# EasyEDA Pro project 外接板20260402.eprj, board PCB2
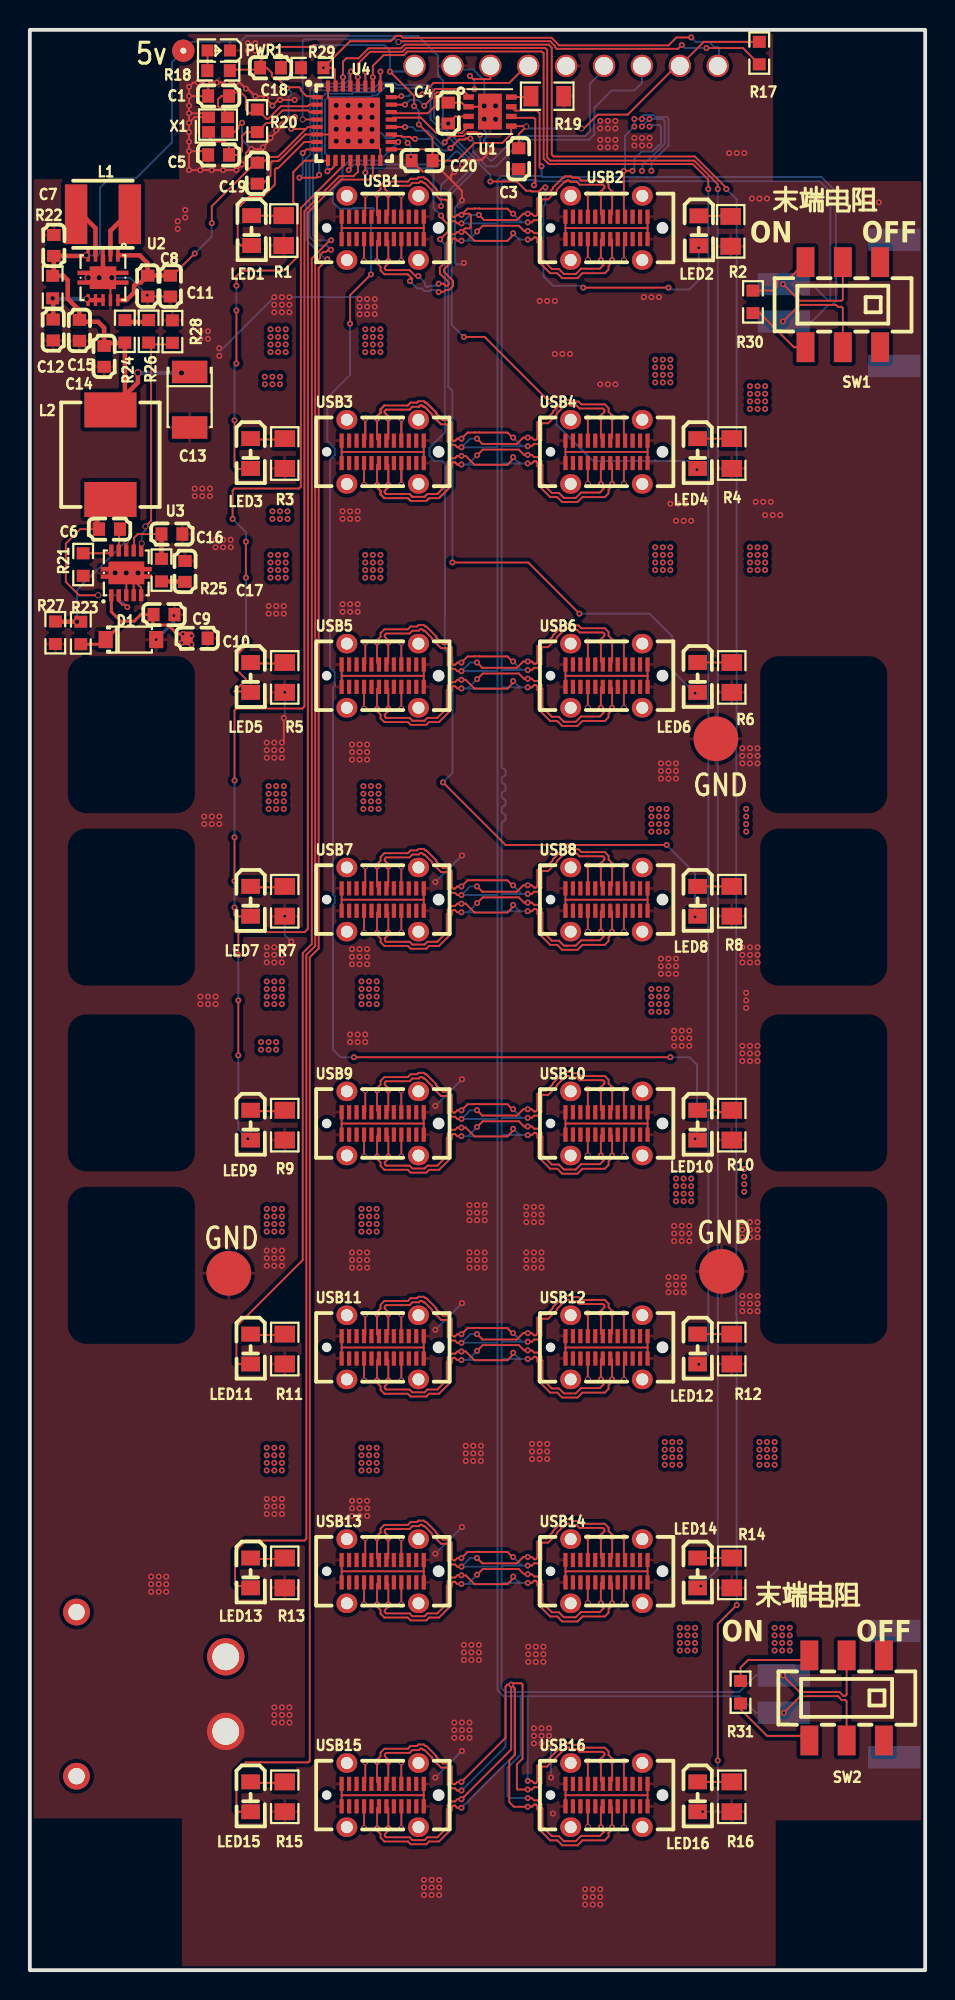
[diagram p2: board, top side]
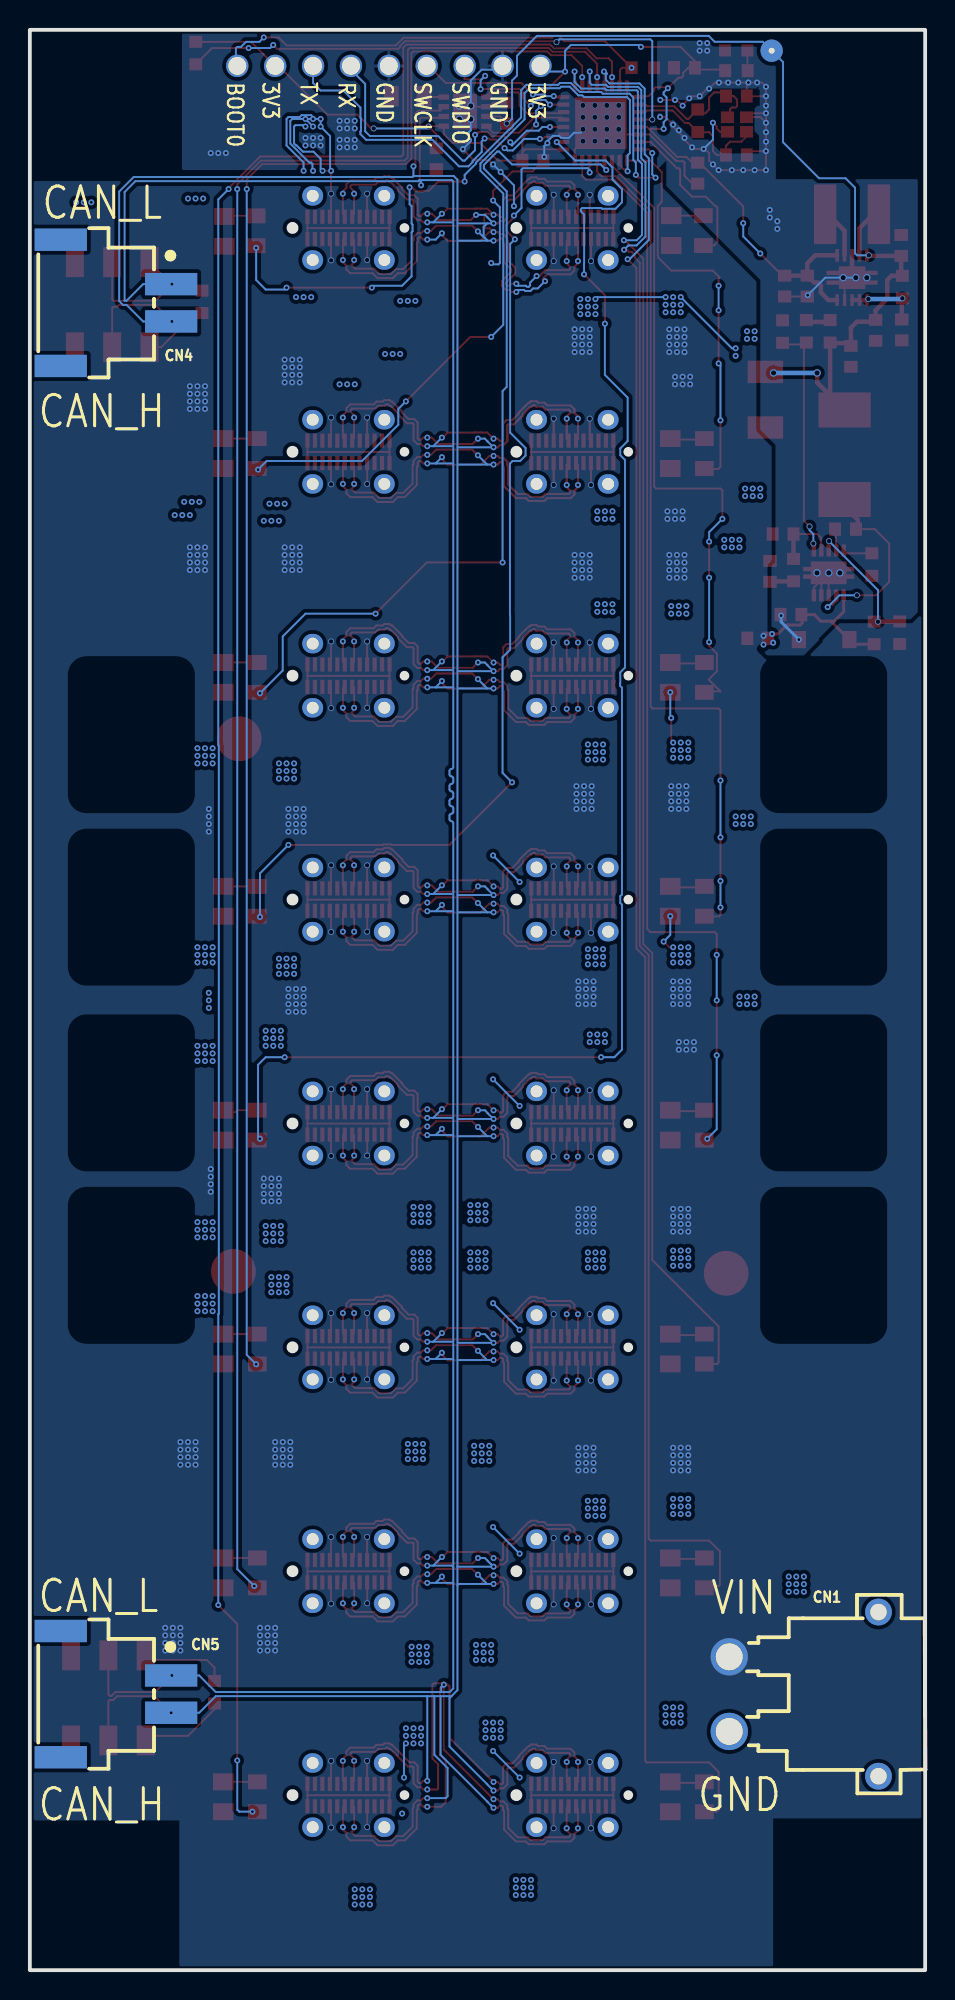
[diagram p3: board, bottom side, seen from below]

Outline 60 x 130 mm; copper layers: Top Layer, Bottom Layer. Coordinates in mm from the lower left corner of the outline.
Outline path: rectangle 0,130 60,0
Stack: Top Layer 0.035mm / Dielectric1 1.51mm FR4 er 4.5 / Bottom Layer 0.035mm

## Design rules (mm)
net OSC_IN: DP2
net OSC_OUT: DP2
net $2N36064: DP3
net $2N36070: DP3
net $2N36103: DP4
net $2N36110: DP4
template: 自定义配置
spacing copperThickness1oz (default): track to track 0.102, other pairs 0.152 to 0.3
spacing copperThickness2oz: track to track 0.203, other pairs 0.152 to 0.3
track width copperThickness1oz (default): min 0.127, default 0.127, max 2.54
track width copperThickness2oz: min 0.203, default 0.254, max 2.54
differential pair differentialPair (default): width min 0.127, default 0.254, max 2.54; gap min 0.152, default 0.152
via viaSize: diameter min 0.5, default 0.61, max 10; hole min 0.3, default 0.305, max 6.3
via viaSize1 (default): diameter min 0.25, default 0.3, max 10; hole min 0.15, default 0.2, max 6.3

## Placement (name value [footprint] x y rotation side)
C1  8pF  [C0603]  12.65 125.57 0 top
C3  100nF  [C0603]  32.76 121.37 90 top
C4  100nF  [C0603]  28.04 124.42 270 top
C5  8pF  [C0603]  12.65 121.62 0 top
C6  100nF  [C0603]  5.34 96.55 0 top
C7  10uF  [C0603]  1.61 115.56 270 top
C8  10UF  [C0603]  7.9 112.83 90 top
C9  10uF  [C0603]  8.99 90.82 180 top
C10  100nF  [C0603]  11.21 89.23 180 top
C11  10uF  [C0603]  9.42 112.83 90 top
C12  100nF  [C0603]  1.57 109.89 90 top
C13  47uF  [CASE-B_3528-A]  10.71 105.22 270 top
C14  47uF  [C0603]  4.98 108.12 90 top
C15  1uF  [C0603]  3.32 109.87 90 top
C16  120pF  [C0603]  9.52 96.22 180 top
C17  0.012uF  [C0603]  10.4 93.72 270 top
C18  100nF  [C0603]  16.13 127.46 180 top
C19  100nF  [C0603]  15.25 120.39 90 top
C20  100nF  [C0603]  26.29 121.24 180 top
CN1  XT30PW-M30.G.Y  [CONN-TH_XT30PW-M]  8.13 18.49 90 bottom
CN4  ZX-XH2.54-2PWT  [CONN-SMD_2P-P2.54_MEGASTAR_ZX-XH2.54-2PWT]  54.23 111.71 270 bottom
CN5  ZX-XH2.54-2PWT  [CONN-SMD_2P-P2.54_MEGASTAR_ZX-XH2.54-2PWT]  54.23 18.49 270 bottom
D1  SMF16A  [SOD-123_L2.8-W1.8-LS3.7-RD]  6.77 89.15 0 top
L1  2.2uH  [IND-SMD_L4.0-W4.0_LQH44PN2R2MP0L]  4.9 117.64 0 top
L2  15uH  [IND-SMD_L7.3-W6.8]  5.4 101.53 90 top
LED1  LS R976-NR-1-0-20-R18  [LED0805-RD_RED]  14.86 116.55 270 top
LED2  LS R976-NR-1-0-20-R18  [LED0805-RD_RED]  44.83 116.54 270 top
LED3  LS R976-NR-1-0-20-R18  [LED0805-RD_RED]  14.8 101.61 270 top
LED4  LS R976-NR-1-0-20-R18  [LED0805-RD_RED]  44.75 101.61 270 top
LED5  LS R976-NR-1-0-20-R18  [LED0805-RD_RED]  14.8 86.61 270 top
LED6  LS R976-NR-1-0-20-R18  [LED0805-RD_RED]  44.75 86.61 270 top
LED7  LS R976-NR-1-0-20-R18  [LED0805-RD_RED]  14.8 71.61 270 top
LED8  LS R976-NR-1-0-20-R18  [LED0805-RD_RED]  44.75 71.61 270 top
LED9  LS R976-NR-1-0-20-R18  [LED0805-RD_RED]  14.8 56.61 270 top
LED10  LS R976-NR-1-0-20-R18  [LED0805-RD_RED]  44.75 56.61 270 top
LED11  LS R976-NR-1-0-20-R18  [LED0805-RD_RED]  14.8 41.61 270 top
LED12  LS R976-NR-1-0-20-R18  [LED0805-RD_RED]  44.75 41.61 270 top
LED13  LS R976-NR-1-0-20-R18  [LED0805-RD_RED]  14.8 26.61 270 top
LED14  LS R976-NR-1-0-20-R18  [LED0805-RD_RED]  44.75 26.61 270 top
LED15  LS R976-NR-1-0-20-R18  [LED0805-RD_RED]  14.8 11.61 270 top
LED16  LS R976-NR-1-0-20-R18  [LED0805-RD_RED]  44.75 11.61 270 top
NOREF  -  [Pad_e3239]  43.56 127.59 0 top
NOREF#2  -  [Pad_e59]  33.4 127.59 0 top
NOREF#3  -  [Pad_e41]  28.32 127.59 0 top
NOREF#4  -  [Pad_e472]  45.97 82.5 0 top
NOREF#5  -  [Pad_e1667]  41.02 127.59 0 top
NOREF#6  -  [Pad_e58]  30.86 127.59 0 top
NOREF#7  -  [Pad_e466]  46.35 46.81 0 top
NOREF#8  -  [Pad_e1678]  38.48 127.59 0 top
NOREF#9  -  [Pad_e3249]  10.29 128.6 0 top
NOREF#10  -  [Pad_e4677]  46.1 127.59 0 top
NOREF#11  -  [Pad_e1689]  35.94 127.59 0 top
NOREF#12  -  [Pad_e40]  25.78 127.59 0 top
NOREF#13  -  [Pad_e468]  13.34 46.69 0 top
PWR1  GL0603UG01  [LED0603-RD]  12.66 128.62 180 top
R1  1kΩ  [R0805#2]  17.02 116.55 270 top
R2  1kΩ  [R0805#2]  46.96 116.5 270 top
R3  1kΩ  [R0805#2]  17.08 101.61 270 top
R4  1kΩ  [R0805#2]  47.04 101.61 270 top
R5  1kΩ  [R0805#2]  17.08 86.61 270 top
R6  1kΩ  [R0805#2]  47.04 86.61 270 top
R7  1kΩ  [R0805#2]  17.08 71.61 270 top
R8  1kΩ  [R0805#2]  47.04 71.61 270 top
R9  1kΩ  [R0805#2]  17.08 56.61 270 top
R10  1kΩ  [R0805#2]  47.04 56.61 270 top
R11  1kΩ  [R0805#2]  17.08 41.61 270 top
R12  1kΩ  [R0805#2]  47.04 41.61 270 top
R13  1kΩ  [R0805#2]  17.08 26.61 270 top
R14  1kΩ  [R0805#2]  47.04 26.61 270 top
R15  1kΩ  [R0805#2]  17.08 11.61 270 top
R16  1kΩ  [R0805#2]  47.04 11.61 270 top
R17  10K  [R0603]  48.88 128.44 90 top
R18  1K  [R0603]  12.65 127.27 0 top
R19  10K  [R0805]  34.67 125.56 0 top
R20  1MΩ  [R0603]  15.24 123.9 90 top
R21  143K  [R0603]  3.57 94.17 90 top
R22  100  [R0603]  1.53 112.77 90 top
R23  220K  [R0603]  3.42 89.59 270 top
R24  51.1  [R0603]  6.37 109.8 270 top
R25  3.74K  [R0603]  8.82 93.8 90 top
R26  100K  [R0603]  7.96 109.8 90 top
R27  43.2K  [R0603]  1.71 89.61 90 top
R28  19.1K  [R0603]  9.55 109.78 270 top
R29  10K  [R0603]  18.92 127.46 0 top
R30  120  [R0603]  48.46 111.78 270 top
R31  120  [R0603]  47.62 18.62 270 top
SW1  MST22D18G2 125  [SW-SMD_MST22D18G2]  54.48 111.59 180 top
SW2  MST22D18G2 125  [SW-SMD_MST22D18G2]  54.74 18.24 180 top
U1  TJA1051TK/3/1J  [HVSON-8_L3.0-W3.0-P0.65-BL-EP]  30.83 124.52 270 top
U2  TPS63001DRCR  [VSON-10_L3.0-W3.0-P0.50-TL-EP_TPS62410DRCR]  4.9 113.39 270 top
U3  TPS54335ADRCR  [VSON-10_L3.0-W3.0-P0.50-TL-EP]  6.46 93.62 90 top
U4  STM32F302K8U6TR  [UFQFPN-32_L5.0-W5.0-P0.50-TL-EP3.5]  21.73 123.74 0 top
USB1  MC-236LS-L64  [TYPE-C-USB-SMD_TYPE-C-31-M-06]  23.65 116.73 0 top
USB2  MC-236LS-L64  [TYPE-C-USB-SMD_TYPE-C-31-M-06]  38.65 116.73 0 top
USB3  MC-236LS-L64  [TYPE-C-USB-SMD_TYPE-C-31-M-06]  23.65 101.73 0 top
USB4  MC-236LS-L64  [TYPE-C-USB-SMD_TYPE-C-31-M-06]  38.65 101.73 0 top
USB5  MC-236LS-L64  [TYPE-C-USB-SMD_TYPE-C-31-M-06]  23.65 86.73 0 top
USB6  MC-236LS-L64  [TYPE-C-USB-SMD_TYPE-C-31-M-06]  38.65 86.73 0 top
USB7  MC-236LS-L64  [TYPE-C-USB-SMD_TYPE-C-31-M-06]  23.65 71.73 0 top
USB8  MC-236LS-L64  [TYPE-C-USB-SMD_TYPE-C-31-M-06]  38.65 71.73 0 top
USB9  MC-236LS-L64  [TYPE-C-USB-SMD_TYPE-C-31-M-06]  23.65 56.73 0 top
USB10  MC-236LS-L64  [TYPE-C-USB-SMD_TYPE-C-31-M-06]  38.65 56.73 0 top
USB11  MC-236LS-L64  [TYPE-C-USB-SMD_TYPE-C-31-M-06]  23.65 41.73 0 top
USB12  MC-236LS-L64  [TYPE-C-USB-SMD_TYPE-C-31-M-06]  38.65 41.73 0 top
USB13  MC-236LS-L64  [TYPE-C-USB-SMD_TYPE-C-31-M-06]  23.65 26.73 0 top
USB14  MC-236LS-L64  [TYPE-C-USB-SMD_TYPE-C-31-M-06]  38.65 26.73 0 top
USB15  MC-236LS-L64  [TYPE-C-USB-SMD_TYPE-C-31-M-06]  23.65 11.73 0 top
USB16  MC-236LS-L64  [TYPE-C-USB-SMD_TYPE-C-31-M-06]  38.65 11.73 0 top
X1  24MHz  [CRYSTAL-SMD_4P-L2.0-W1.6-BL-A]  12.61 123.65 0 top

## Footprints (pads in the part's own frame, mm; a bottom-side part is the same pattern mirrored in y, then rotated)
C0603
  rect 0.8x0.9 smd: 1(-0.7,0) 2(0.7,0)
CASE-B_3528-A
  rect 1.506x2.376 smd: 1(-1.861,0) 2(1.861,0)
CONN-SMD_2P-P2.54_MEGASTAR_ZX-XH2.54-2PWT
  rect 1.5x3.5 smd: 1(-1.25,3.7) 2(1.25,3.7) 3(-4.23,-3.7) 4(4.23,-3.7)
CONN-TH_XT30PW-M
  round 2.5 hole 1.8: 1(-2.5,5) 2(2.5,5)
  round 1.8 hole 1.1: 3(5.5,-5) 4(-5.5,-5)
CRYSTAL-SMD_4P-L2.0-W1.6-BL-A
  rect 0.875x0.775 smd: 1(-0.638,-0.488) 2(0.638,-0.488) 3(0.638,0.488) 4(-0.638,0.488)
HVSON-8_L3.0-W3.0-P0.65-BL-EP
  rect 0.355x0.711 smd: 1(-0.976,-1.433) 2(-0.325,-1.433) 3(0.325,-1.433) 4(0.976,-1.433) 5(0.976,1.433) 6(0.325,1.433) 7(-0.325,1.433) 8(-0.976,1.433)
  rect 2.401x1.6 smd: 9(0,0)
IND-SMD_L4.0-W4.0_LQH44PN2R2MP0L
  rect 1.5x4 smd: 1(-1.8,0) 2(1.8,0)
IND-SMD_L7.3-W6.8
  rect 2.349x3.5 smd: 1(-2.999,0) 2(2.999,0)
LED0603-RD
  rect 0.8x0.8 smd: 1(-0.749,0) 2(0.749,0)
LED0805-RD_RED
  rect 1x1.25 smd: 1(-1,0) 2(1,0)
Pad_e40
  round 1.5 hole 1.2: 1(0,0)
Pad_e41
  round 1.5 hole 1.2: 1(0,0)
Pad_e58
  round 1.5 hole 1.2: 1(0,0)
Pad_e59
  round 1.5 hole 1.2: 1(0,0)
Pad_e466
  round 3 smd: TP2(0,0)
Pad_e468
  round 3 smd: TP2(0,0)
Pad_e472
  round 3 smd: TP2(0,0)
Pad_e1667
  round 1.5 hole 1.2: 1(0,0)
Pad_e1678
  round 1.5 hole 1.2: 1(0,0)
Pad_e1689
  round 1.5 hole 1.2: 1(0,0)
Pad_e3239
  round 1.5 hole 1.2: 1(0,0)
Pad_e3249
  round 1.5 hole 0.4: 1(0,0)
Pad_e4677
  round 1.5 hole 1.2: 1(0,0)
R0603
  rect 0.806x0.864 smd: 1(-0.753,0) 2(0.753,0)
R0805
  rect 1x1.377 smd: 1(-1.092,0) 2(1.105,0)
R0805#2
  rect 1.133x1.377 smd: 1(-1,0) 2(1,0)
SOD-123_L2.8-W1.8-LS3.7-RD
  rect 0.95x1.15 smd: 1(-1.692,0) 2(1.692,0)
SW-SMD_MST22D18G2
  rect 1.2x2 smd: 1(-2.5,2.85) 2(0,2.85) 3(2.5,2.85) 4(-2.5,-2.85) 5(0,-2.85) 6(2.5,-2.85)
TYPE-C-USB-SMD_TYPE-C-31-M-06
  oval 1.4x1.3 hole 0.8: 25(-2.401,2.15) 25(-2.401,-2.15) 25(2.399,2.15) 25(2.399,-2.15)
  rect 0.28x0.95 smd: A1(-2.751,0.75) A2(-2.251,0.75) A3(-1.751,0.75) A4(-1.251,0.75) A5(-0.751,0.75) A6(-0.251,0.75) A7(0.249,0.75) A8(0.749,0.75) A9(1.249,0.75) A10(1.749,0.75) A11(2.249,0.75) A12(2.749,0.75) B1(2.751,-0.751) B2(2.251,-0.751) B3(1.751,-0.751) B4(1.251,-0.751) B5(0.751,-0.751) B6(0.251,-0.751) B7(-0.249,-0.751) B8(-0.749,-0.751) B9(-1.249,-0.751) B10(-1.749,-0.751) B11(-2.249,-0.751) B12(-2.749,-0.751)
UFQFPN-32_L5.0-W5.0-P0.50-TL-EP3.5
  rect 0.75x0.28 smd: 1(-2.49,1.75) 2(-2.49,1.25) 3(-2.49,0.75) 4(-2.49,0.25) 5(-2.49,-0.25) 6(-2.49,-0.75) 7(-2.49,-1.25) 8(-2.49,-1.75) 17(2.49,-1.75) 18(2.49,-1.25) 19(2.49,-0.75) 20(2.49,-0.25) 21(2.49,0.25) 22(2.49,0.75) 23(2.49,1.25) 24(2.49,1.75)
  rect 0.28x0.75 smd: 9(-1.75,-2.49) 10(-1.25,-2.49) 11(-0.75,-2.49) 12(-0.25,-2.49) 13(0.25,-2.49) 14(0.75,-2.49) 15(1.25,-2.49) 16(1.75,-2.49) 25(1.75,2.49) 26(1.25,2.49) 27(0.75,2.49) 28(0.25,2.49) 29(-0.25,2.49) 30(-0.75,2.49) 31(-1.25,2.49) 32(-1.75,2.49)
  rect 3.45x3.45 smd: 33(0,0)
VSON-10_L3.0-W3.0-P0.50-TL-EP
  rect 0.8x0.3 smd: 1(-1.5,1) 2(-1.5,0.5) 3(-1.5,0) 4(-1.5,-0.5) 5(-1.5,-1) 6(1.5,-1) 7(1.5,-0.5) 8(1.5,0) 9(1.5,0.5) 10(1.5,1)
  custom 1.52x3.42 smd: 11(0.002,-0.009)
VSON-10_L3.0-W3.0-P0.50-TL-EP_TPS62410DRCR
  rect 0.85x0.24 smd: 1(-1.5,1) 2(-1.5,0.5) 3(-1.5,0) 4(-1.5,-0.5) 5(-1.5,-1)
  rect 0.8x0.23 smd: 6(1.5,-1) 7(1.5,-0.5) 8(1.5,0) 9(1.5,0.5) 10(1.5,1)
  custom 1.52x3.42 smd: 11(0,-0.005)

## Nets
As in the schematic, except:
3V3: C3.2 C8.2 C11.2 C18.2 C19.2 C20.1 NOREF.1 NOREF#12.1 R17.2 R18.2 U1.5 U2.1 U2.10 U4.1 U4.5 U4.17
+5V: C4.2 C7.2 C13.1 C14.2 C15.2 L2.2 NOREF#9.1 R22.2 R24.2 U1.3 U2.5
GND: C1.1 C3.1 C4.1 C5.1 C7.1 C8.1 C9.1 C10.1 C11.1 C12.1 C13.2 C14.1 C15.1 C16.1 C17.1 C18.1 C19.1 C20.2 CN1.1 D1.2 NOREF#3.1 NOREF#4.TP2 NOREF#7.TP2 NOREF#11.1 NOREF#13.TP2 PWR1.1 R1.2 R2.2 R3.2 R4.2 R5.2 R6.2 R7.2 R8.2 R9.2 R10.2 R11.2 R12.2 R13.2 R14.2 R15.2 R16.2 R19.2 R21.1 R27.1 R28.1 R29.1 U1.2 U1.9 U2.3 U2.9 U2.11 U3.3 U3.4 U3.5 U3.11 U4.6 U4.16 U4.32 U4.33 USB1.A1 USB1.A12 USB1.B1 USB1.B12 USB2.A1 USB2.A12 USB2.B1 USB2.B12 USB3.A1 USB3.A12 USB3.B1 USB3.B12 USB4.A1 USB4.A12 USB4.B1 USB4.B12 USB5.A1 USB5.A12 USB5.B1 USB5.B12 USB6.A1 USB6.A12 USB6.B1 USB6.B12 USB7.A1 USB7.A12 USB7.B1 USB7.B12 USB8.A1 USB8.A12 USB8.B1 USB8.B12 USB9.A1 USB9.A12 USB9.B1 USB9.B12 USB10.A1 USB10.A12 USB10.B1 USB10.B12 USB11.A1 USB11.A12 USB11.B1 USB11.B12 USB12.A1 USB12.A12 USB12.B1 USB12.B12 USB13.A1 USB13.A12 USB13.B1 USB13.B12 USB14.A1 USB14.A12 USB14.B1 USB14.B12 USB15.A1 USB15.A12 USB15.B1 USB15.B12 USB16.A1 USB16.A12 USB16.B1 USB16.B12 X1.2 X1.4
BOOT0: NOREF#10.1 R29.2 U4.31
RX: NOREF#8.1 U4.20
SWCLK: NOREF#2.1 U4.24
SWDIO: NOREF#6.1 U4.23
TX: NOREF#5.1 U4.19

Pads without a net: CN1 3 4; CN4 3 4; CN5 3 4; SW1 1 4; SW2 1 4; USB1 25 A2 A3 A5 A8 A10 A11 B2 B3 B5 B8 B10 B11; USB2 25 A2 A3 A5 A8 A10 A11 B2 B3 B5 B8 B10 B11; USB3 25 A2 A3 A5 A8 A10 A11 B2 B3 B5 B8 B10 B11; USB4 25 A2 A3 A5 A8 A10 A11 B2 B3 B5 B8 B10 B11; USB5 25 A2 A3 A5 A8 A10 A11 B2 B3 B5 B8 B10 B11; USB6 25 A2 A3 A5 A8 A10 A11 B2 B3 B5 B8 B10 B11; USB7 25 A2 A3 A5 A8 A10 A11 B2 B3 B5 B8 B10 B11; USB8 25 A2 A3 A5 A8 A10 A11 B2 B3 B5 B8 B10 B11; USB9 25 A2 A3 A5 A8 A10 A11 B2 B3 B5 B8 B10 B11; USB10 25 A2 A3 A5 A8 A10 A11 B2 B3 B5 B8 B10 B11; USB11 25 A2 A3 A5 A8 A10 A11 B2 B3 B5 B8 B10 B11; USB12 25 A2 A3 A5 A8 A10 A11 B2 B3 B5 B8 B10 B11; USB13 25 A2 A3 A5 A8 A10 A11 B2 B3 B5 B8 B10 B11; USB14 25 A2 A3 A5 A8 A10 A11 B2 B3 B5 B8 B10 B11; USB15 25 A2 A3 A5 A8 A10 A11 B2 B3 B5 B8 B10 B11; USB16 25 A2 A3 A5 A8 A10 A11 B2 B3 B5 B8 B10 B11

## Via types
v1: diameter 0.4, hole 0.2, Top Layer to Bottom Layer, 1050 vias
v2: diameter 0.4, hole 0.35, Top Layer to Bottom Layer, 16 vias
v3: diameter 0.5, hole 0.35, Top Layer to Bottom Layer, 12 vias
v4: diameter 0.4, hole 0.3, Top Layer to Bottom Layer, 77 vias

## Routing (per net, layer and track width the routed paths; a pad name or vN(x,y) marks a point on that pad's centre or on a via; arc(x,y) is an arc through that point)
3V3: length 84.3
  Top Layer w0.127: 9.44,113.53 9.57,113.53 v1(11.05,115.01) ; v1(25.75,124.89) 25.75,125.58 v1(24.13,127.21) ; 19.24,123.49 18.64,123.49 18.51,123.36 ; 18.51,123.36 16.64,121.49 16,121.49 15.6,121.09 C19.2 ; 18.51,123.36 v1(17.53,123.36) ; 19.24,125.49 19.18,125.56 18.54,125.56 18.16,125.94 18.16,126.06 18.07,126.15 17.31,126.15 v1(17.25,126.09) 16.54,126.79 16.34,126.79 16.21,126.92 16.21,127.12 15.88,127.46 C18.2 15.43,127.9 16.38,128.86 v1(19.05,128.86) ; U4.17 24.23,122 26.8,122 26.99,121.81 ; 15.8,127.33 13.72,127.33 13.4,127.01 ; 26.99,121.81 26.99,122.74 v1(26.07,123.66) ; 26.99,121.81 C20.1 28.62,121.24 29.81,122.42 31.67,122.42 32.26,123.02 32.26,123.54 32.26,123.55 33.25,123.55 v4(33.27,123.52) 32.77,123.02 32.77,122.08 C3.2 ; v4(36.96,123.4) 37.13,123.4 38.06,124.32 40.07,124.32 42.93,127.18 43.56,127.18 ; NOREF.1 45.17,129.2 R17.2 ; v1(12.19,117.05) 12.19,118.18 15.26,121.25 15.26,121.47
  Top Layer w0.3: C11.2 C8.2 ; C8.2 7.9,114.36 7.36,114.89 U2.1 ; C8.2 7.43,113.07 7.2,113.07 6.98,112.85 6.98,112.4 6.48,111.89 U2.10
  Bottom Layer w0.127: v1(11.05,115.01) 12.19,116.16 v1(12.19,117.05) ; v1(26.07,123.66) 26.07,124.57 v1(25.75,124.89) ; v4(33.27,123.52) 33.4,123.4 v4(36.96,123.4) ; 25.78,127.08 25.65,127.21 v1(24.13,127.21) 24.13,128.6 23.75,128.98 19.14,128.98 19.05,128.89 v1(19.05,128.86) ; v1(17.53,123.36) 17.53,123.81 17.33,124.01 17.33,125.47 17.53,125.67 17.53,125.81 v1(17.25,126.09)
+5V: length 65.1
  Top Layer w0.127: v4(28.04,123.72) 28.51,124.2 U1.3
  Top Layer w0.3: v3(7.24,107.01) 7.24,106.37 L2.2 ; v4(3.77,114.89) 3.74,114.86 C7.2 1.61,113.6 1.53,113.52 2.25,113.52 2.54,113.24 2.54,111.99 3.32,111.2 C15.2 ; 5.04,109.01 6.28,109.01 6.37,108.92 6.37,105.63 5.4,104.66 ; 4.92,109.01 4.98,109.08 4.98,110.04 4.57,110.44 3.32,110.44
  Bottom Layer w0.127: v4(3.77,114.89) 4.57,114.89 4.7,115.02 4.7,119.42 5.33,120.06 7.11,120.06 9.52,122.47 9.52,127.84 NOREF#9.1 10.88,129.2 14.11,129.2 14.5,129.59 26.02,129.59 27.36,128.26 27.36,126.93 27.69,126.6 27.69,124.04 28,123.72 v4(28.04,123.72)
  Bottom Layer w0.3: v3(7.24,107.01) v3(10.16,107.01)
GND: length 258.5
  Top Layer w0.127: 26.4,26.71 USB13.B1 ; 26.4,26.71 26.38,26.72 20.9,26.72 ; 26.4,26.71 26.4,27.48 USB13.A12 ; 20.9,86.72 USB5.B12 ; 20.9,86.72 20.9,87.48 USB5.A1 ; 20.9,86.72 26.38,86.72 26.4,86.71 ; 41.4,71.71 41.4,72.48 USB8.A12 ; 41.4,71.71 41.38,71.72 35.9,71.72 ; 41.4,71.71 USB8.B1 ; 35.9,116.72 35.9,117.48 USB2.A1 ; 35.9,116.72 41.38,116.72 41.4,116.71 ; 35.9,116.72 USB2.B12 ; v1(10.67,121.87) 11.7,121.87 C5.1 ; v1(10.67,121.87) v1(10.67,120.6) v1(11.43,120.6) v1(12.19,120.6) v1(12.95,120.6) v1(13.84,120.6) v1(14.22,120.98) 14.48,121.24 14.48,121.75 14.75,122.02 v1(14.85,122.02) 15.51,122.02 v1(15.62,122.13) 16.13,122.63 v1(16.13,122.76) 16.89,123.52 v1(16.89,123.65) 17.4,124.16 v1(17.76,124.16) ; v1(10.67,121.87) v1(10.67,122.51) v1(10.67,123.14) v1(10.67,123.78) ; 41.4,56.71 41.38,56.72 35.9,56.72 ; 41.4,56.71 41.4,57.48 USB10.A12 ; 41.4,56.71 USB10.B1 ; 20.9,56.72 26.38,56.72 26.4,56.71 ; 20.9,56.72 USB9.B12 ; 20.9,56.72 20.9,57.48 USB9.A1 ; 20.9,71.72 26.38,71.72 26.4,71.71 ; 20.9,71.72 USB7.B12 ; 20.9,71.72 20.9,72.48 USB7.A1 ; USB16.A12 41.4,12.48 41.4,11.71 ; 41.4,101.71 41.38,101.72 35.9,101.72 ; 41.4,101.71 USB4.B1 ; 41.4,101.71 41.4,102.48 USB4.A12 ; X1.2 13.74,123.16 13.97,123.4 13.97,123.52 v1(14.22,123.78) ; 35.9,56.72 USB10.B12 ; 35.9,56.72 35.9,57.48 USB10.A1 ; 26.4,41.71 26.4,42.48 USB11.A12 ; 26.4,41.71 26.38,41.72 20.9,41.72 ; 26.4,41.71 USB11.B1 ; 6.96,93.13 U3.11 6.47,92.12 U3.3 ; 6.96,93.13 7.46,92.63 U3.5 ; 6.96,93.13 U3.4 ; 41.4,41.71 41.4,42.48 USB12.A12 ; 41.4,41.71 41.38,41.72 35.9,41.72 ; 41.4,41.71 USB12.B1 ; 41.4,11.71 41.38,11.72 35.9,11.72 ; 41.4,11.71 USB16.B1 ; 11.84,124.27 X1.4 ; 11.84,124.27 11.72,124.16 11.05,124.16 v1(10.67,123.78) ; 11.84,124.27 11.7,124.41 v1(10.67,124.41) ; 26.4,71.71 26.4,72.48 USB7.A12 ; 26.4,71.71 USB7.B1 ; 35.9,101.72 USB4.B12 ; 35.9,101.72 35.9,102.48 USB4.A1 ; v1(17.53,68.91) 17.15,68.53 v1(16.89,68.53) ; USB6.A1 35.9,87.48 35.9,86.72 ; v1(10.67,125.56) v1(10.67,126.19) 10.95,126.47 v1(11.26,126.47) v1(11.84,126.47) ; v1(10.67,125.56) 11.81,125.56 11.82,125.57 ; v1(10.67,125.56) v1(10.67,124.92) v1(10.67,124.41) ; v1(28.96,118.57) 28.96,119.2 28.24,119.92 ; 35.9,26.72 35.9,27.48 USB14.A1 ; 35.9,26.72 41.38,26.72 41.4,26.71 ; 35.9,26.72 USB14.B12 ; 26.4,101.71 USB3.B1 ; 26.4,101.71 26.4,102.48 USB3.A12 ; 26.4,101.71 26.38,101.72 20.9,101.72 ; 26.4,11.71 26.38,11.72 20.9,11.72 ; 26.4,11.71 26.4,12.48 USB15.A12 ; 26.4,11.71 USB15.B1 ; 35.9,71.72 USB8.B12 ; 35.9,71.72 35.9,72.48 USB8.A1 ; USB15.A1 20.9,12.48 20.9,11.72 ; 20.9,101.72 USB3.B12 ; 20.9,101.72 20.9,102.48 USB3.A1 ; v1(7.87,112.22) 7.96,112.13 C11.1 ; C4.1 28.94,125.12 29.09,124.97 29.27,124.97 U1.2 30.4,124.85 v3(30.45,124.9) ; 41.4,116.71 41.4,117.48 USB2.A12 ; 41.4,116.71 USB2.B1 ; 28.24,119.92 28.24,120.27 v1(28.45,120.47) ; 28.24,119.92 27.65,120.51 26.31,120.51 C20.2 ; v3(5.49,113.39) 5.4,113.3 U2.9 ; 35.9,11.72 35.9,12.48 USB16.A1 ; 35.9,11.72 USB16.B12 ; 26.4,56.71 USB9.B1 ; 26.4,56.71 26.4,57.48 USB9.A12 ; 41.4,86.71 USB6.B1 ; 41.4,86.71 41.38,86.72 35.9,86.72 ; 41.4,86.71 41.4,87.48 USB6.A12 ; C1.1 11.95,126.36 v1(11.84,126.47) ; 20.9,41.72 USB11.B12 ; 20.9,41.72 20.9,42.48 USB11.A1 ; 20.9,11.72 USB15.B12 ; 35.9,41.72 35.9,42.48 USB12.A1 ; 35.9,41.72 USB12.B12 ; 20.9,26.72 USB13.B12 ; 20.9,26.72 20.9,27.48 USB13.A1 ; U4.33 22.05,123.42 23.48,121.99 23.48,121.25 ; U4.33 21.25,124.22 19.98,125.49 U4.32 ; U4.33 v2(21.33,123.34) 20.98,122.99 18.46,122.99 16.73,121.26 16.7,121.26 16.64,121.2 16.22,121.2 16.13,121.11 16.13,120.22 15.62,119.71 15.37,119.71 15.25,119.83 C19.1 ; v1(10.67,123.78) v1(10.67,124.41) ; 26.4,86.71 26.4,87.48 USB5.A12 ; 26.4,86.71 USB5.B1 ; 41.4,26.71 41.4,27.48 USB14.A12 ; 41.4,26.71 USB14.B1 ; 35.9,86.72 USB6.B12 ; 26.4,116.71 26.38,116.72 20.9,116.72 ; 26.4,116.71 26.4,117.48 USB1.A12 ; 26.4,116.71 USB1.B1 ; 20.9,116.72 USB1.B12 ; 20.9,116.72 20.9,117.48 USB1.A1 ; v1(17.75,125.3) v1(16.76,125.3) 16.64,125.3 v1(16.26,124.92) 16.26,124.97 v1(15.81,125.41) 15.67,125.56 v1(15.11,125.56) 14.6,126.06 v1(14.48,126.06) 14.07,126.47 v1(13.82,126.47) v1(13.21,126.47) v1(12.53,126.47) v1(11.84,126.47) ; v1(16.89,82.25) 17.02,82.38 v1(17.02,83.9) ; v1(28.96,120.98) 29.25,121.27 30.26,121.27 30.98,121.99 v1(30.98,122.01)
  Top Layer w0.3: v3(5.49,113.39) 4.9,113.99 U2.3
  Bottom Layer w0.127: v1(34.93,12.91) 34.93,15.06 v1(34.8,15.19) ; v1(27.56,118.19) 27.56,119.59 v1(28.45,120.47) v1(28.96,120.98) ; U2.11 v3(5.49,113.39) 6.7,113.39 v1(7.87,112.22) ; v1(27.18,27.91) v1(28.96,29.68) ; v1(16.38,112.09) 12.95,108.66 v1(12.7,108.66) ; v1(14.22,123.78) 14.22,122.64 v1(14.85,122.02) ; v1(17.4,112.09) 21.97,112.09 v1(22.1,111.97) ; v1(17.53,68.91) 17.08,69.36 v1(17.08,70.61) ; v1(30.98,122.01) 30.45,122.54 30.45,122.67 30.58,122.8 30.58,123.14 30.45,123.27 v3(30.45,124.01) ; v1(17.02,83.9) 17.08,83.96 v1(17.08,85.61) ; 23.06,123.11 23.53,123.11 23.88,122.76 24.38,122.76 24.52,122.9 24.95,122.9 25.32,122.53 v1(25.32,122.41) 25.53,122.2 v1(25.53,121.49) ; v1(27.18,12.91) v1(28.96,14.68) ; v1(29.08,114.38) 28.99,114.29 28.59,114.29 28.5,114.38 28.5,118.11 v1(28.96,118.57) ; v1(27.18,72.91) v1(28.96,74.68) ; v1(27.18,57.91) v1(28.96,59.68) ; v3(30.45,124.9) 30.45,126.6 29.72,127.33 28.32,127.33 ; v1(27.18,42.91) v1(28.96,44.68)
  Bottom Layer w0.2: v1(8.47,89.15) 9.65,90.33 v1(9.65,90.76)
  vias: v1(8.13,26.37) v1(8.13,25.86) v1(8.13,25.35) v1(8.64,26.37) v1(8.64,25.86) v1(8.64,25.35) v1(9.14,26.37) v1(9.14,25.86) v1(9.14,25.35) v1(9.91,117.17) v1(9.91,116.66) v1(10.41,117.94) v1(10.41,117.43) v1(11.05,99.27) v1(11.05,98.76) v1(11.43,109.81) v1(11.43,109.3) v1(11.43,65.23) v1(11.43,64.72) v1(11.56,99.27) v1(11.56,98.76) v1(11.68,77.3) v1(11.68,76.79) v1(11.94,109.81) v1(11.94,109.3) v1(11.94,65.23) v1(11.94,64.72) v1(12.06,99.27) v1(12.06,98.76) v1(12.19,77.3) v1(12.19,76.79) v1(12.45,95.84) v1(12.45,95.33) v1(12.45,65.23) v1(12.45,64.72) v1(12.7,108.16) v1(12.7,77.3) v1(12.7,76.79) v1(12.95,95.84) v1(12.95,95.33) v1(13.46,95.84) v1(13.46,95.33) v1(14.6,129.11) v1(14.6,128.6) v1(15.11,129.11) v1(15.11,128.6) v1(15.87,82.25) v1(15.87,81.74) v1(15.87,81.23) v1(15.87,68.53) v1(15.87,68.02) v1(15.87,67.52) v1(15.87,48.21) v1(15.87,47.7) v1(15.87,47.2) v1(15.88,31.57) v1(15.88,31.07) v1(15.88,30.56) v1(16,91.39) v1(16,90.88) v1(16.38,111.59) v1(16.38,111.08) v1(16.38,82.25) v1(16.38,81.74) v1(16.38,81.23) v1(16.38,68.53) v1(16.38,68.02) v1(16.38,67.52) v1(16.38,48.21) v1(16.38,47.7) v1(16.38,47.2) v1(16.38,31.57) v1(16.38,31.07) v1(16.38,30.56) v1(16.38,17.6) v1(16.38,17.1) v1(16.38,16.59) v1(16.51,123.27) v1(16.51,91.39) v1(16.51,90.88) v1(16.89,112.09) v1(16.89,111.59) v1(16.89,111.08) v1(16.89,81.74) v1(16.89,81.23) v1(16.89,68.02) v1(16.89,67.52) v1(16.89,48.21) v1(16.89,47.7) v1(16.89,47.2) v1(16.89,31.57) v1(16.89,31.07) v1(16.89,30.56) v1(16.89,17.6) v1(16.89,17.1) v1(16.89,16.59) v1(17.02,91.39) v1(17.02,90.88) v1(17.4,111.59) v1(17.4,111.08) v1(17.4,17.6) v1(17.4,17.1) v1(17.4,16.59) v1(20.96,97.74) v1(20.96,97.23) v1(20.96,91.52) v1(20.96,91.01) v1(21.46,97.74) v1(21.46,97.23) v1(21.46,91.52) v1(21.46,91.01) v1(21.46,62.69) v1(21.46,62.18) v1(21.59,82.12) v1(21.59,81.61) v1(21.59,81.11) v1(21.59,68.41) v1(21.59,67.9) v1(21.59,67.39) v1(21.59,48.08) v1(21.59,47.58) v1(21.59,47.07) v1(21.59,31.45) v1(21.59,30.94) v1(21.59,30.43) v1(21.97,97.74) v1(21.97,97.23) v1(21.97,91.52) v1(21.97,91.01) v1(21.97,62.69) v1(21.97,62.18) v1(22.1,111.46) v1(22.1,110.95) v1(22.1,82.12) v1(22.1,81.61) v1(22.1,81.11) v1(22.1,68.41) v1(22.1,67.9) v1(22.1,67.39) v1(22.1,48.08) v1(22.1,47.58) v1(22.1,47.07) v1(22.1,31.45) v1(22.1,30.94) v1(22.1,30.43) v1(22.48,62.69) v1(22.48,62.18) v1(22.6,111.97) v1(22.6,111.46) v1(22.6,110.95) v1(22.6,82.12) v1(22.6,81.61) v1(22.6,81.11) v1(22.6,68.41) v1(22.6,67.9) v1(22.6,67.39) v1(22.6,48.08) v1(22.6,47.58) v1(22.6,47.07) v1(22.61,31.45) v1(22.61,30.94) v1(22.61,30.43) v1(23.11,111.97) v1(23.11,111.46) v1(23.11,110.95) v1(26.42,6.05) v1(26.42,5.54) v1(26.42,5.03) v1(26.92,6.05) v1(26.92,5.54) v1(26.92,5.03) v1(27.43,6.05) v1(27.43,5.54) v1(27.43,5.03) v1(28.45,16.59) v1(28.45,16.08) v1(28.45,15.57) v1(28.96,16.59) v1(28.96,16.08) v1(28.96,15.57) v1(29.08,21.8) v1(29.08,21.29) v1(29.08,20.78) v1(29.21,35.13) v1(29.21,34.62) v1(29.21,34.12) v1(29.46,51.26) v1(29.46,50.75) v1(29.46,50.24) v1(29.46,48.08) v1(29.46,47.58) v1(29.46,47.07) v1(29.46,16.59) v1(29.46,16.08) v1(29.46,15.57) v1(29.59,21.8) v1(29.59,21.29) v1(29.59,20.78) v1(29.72,35.13) v1(29.72,34.62) v1(29.72,34.12) v1(29.97,51.26) v1(29.97,50.75) v1(29.97,50.24) v1(29.97,48.08) v1(29.97,47.58) v1(29.97,47.07) v1(30.1,21.8) v1(30.1,21.29) v1(30.1,20.78) v1(30.23,35.13) v1(30.23,34.62) v1(30.23,34.12) v1(30.48,51.26) v1(30.48,50.75) v1(30.48,50.24) v1(30.48,48.08) v1(30.48,47.58) v1(30.48,47.07) v1(33.27,51.13) v1(33.27,50.62) v1(33.27,50.12) v1(33.27,48.08) v1(33.27,47.58) v1(33.27,47.07) v1(33.4,21.67) v1(33.4,21.16) v1(33.4,20.65) v1(33.66,35.26) v1(33.66,34.75) v1(33.66,34.24) v1(33.78,51.13) v1(33.78,50.62) v1(33.78,50.12) v1(33.78,48.08) v1(33.78,47.58) v1(33.78,47.07) v1(33.78,16.21) v1(33.78,15.7) v1(33.78,15.19) v1(33.91,21.67) v1(33.91,21.16) v1(33.91,20.65) v1(34.16,111.84) v1(34.16,35.26) v1(34.16,34.75) v1(34.16,34.24) v1(34.29,51.13) v1(34.29,50.62) v1(34.29,50.12) v1(34.29,48.08) v1(34.29,47.58) v1(34.29,47.07) v1(34.29,16.21) v1(34.29,15.7) v1(34.29,15.19) v1(34.42,21.67) v1(34.42,21.16) v1(34.42,20.65) v1(34.67,111.84) v1(34.67,35.26) v1(34.67,34.75) v1(34.67,34.24) v1(34.8,16.21) v1(34.8,15.7) v1(35.05,10.49) v1(35.18,111.84) v1(35.18,108.28) v1(35.69,108.28) v1(36.19,108.28) v1(37.21,5.41) v1(37.21,4.91) v1(37.21,4.4) v1(37.72,5.41) v1(37.72,4.91) v1(37.72,4.4) v1(38.23,123.9) v1(38.23,123.4) v1(38.23,122.63) v1(38.23,122.13) v1(38.23,106.25) v1(38.23,5.41) v1(38.23,4.91) v1(38.23,4.4) v1(38.74,123.9) v1(38.74,123.4) v1(38.74,122.63) v1(38.74,122.13) v1(38.74,106.25) v1(39.24,123.9) v1(39.24,123.4) v1(39.24,122.63) v1(39.24,122.13) v1(39.24,106.25) v1(40.51,122.76) v1(40.51,122.25) v1(41.02,122.76) v1(41.02,122.25) v1(41.15,112.09) v1(41.53,122.76) v1(41.53,122.25) v1(41.66,112.09) v1(42.16,112.09) v1(42.29,80.85) v1(42.29,80.34) v1(42.29,79.83) v1(42.29,67.77) v1(42.29,67.26) v1(42.29,66.75) v1(42.8,80.85) v1(42.8,80.34) v1(42.8,79.83) v1(42.8,67.77) v1(42.8,67.26) v1(42.8,66.75) v1(42.8,46.43) v1(42.8,45.93) v1(42.8,45.42) v1(42.93,98.25) v1(43.18,62.94) v1(43.18,62.44) v1(43.18,61.93) v1(43.18,49.86) v1(43.18,49.36) v1(43.18,48.85) v1(43.31,97.11) v1(43.31,80.85) v1(43.31,80.34) v1(43.31,79.83) v1(43.31,67.77) v1(43.31,67.26) v1(43.31,66.75) v1(43.31,46.43) v1(43.31,45.93) v1(43.31,45.42) v1(43.43,98.25) v1(43.69,62.94) v1(43.69,62.44) v1(43.69,61.93) v1(43.69,49.86) v1(43.69,49.36) v1(43.69,48.85) v1(43.81,97.11) v1(43.81,46.43) v1(43.81,45.93) v1(43.81,45.42) v1(43.94,98.25) v1(44.2,62.94) v1(44.2,62.44) v1(44.2,61.93) v1(44.2,49.86) v1(44.2,49.36) v1(44.2,48.85) v1(44.32,97.11) v1(46.86,121.75) v1(47.37,121.75) v1(47.75,81.87) v1(47.75,81.36) v1(47.75,80.85) v1(47.75,68.53) v1(47.75,68.02) v1(47.75,67.52) v1(47.75,61.93) v1(47.75,61.42) v1(47.75,60.91) v1(47.75,50.12) v1(47.75,49.61) v1(47.75,49.1) v1(47.75,45.16) v1(47.75,44.66) v1(47.75,44.15) v1(47.88,121.75) v1(48.01,65.48) v1(48.01,64.98) v1(48.01,64.47) v1(48.26,81.87) v1(48.26,81.36) v1(48.26,80.85) v1(48.26,68.53) v1(48.26,68.02) v1(48.26,67.52) v1(48.26,61.93) v1(48.26,61.42) v1(48.26,60.91) v1(48.26,50.12) v1(48.26,49.61) v1(48.26,49.1) v1(48.26,45.16) v1(48.26,44.66) v1(48.26,44.15) v1(48.39,118.7) v1(48.64,98.38) v1(48.77,81.87) v1(48.77,81.36) v1(48.77,80.85) v1(48.77,68.53) v1(48.77,68.02) v1(48.77,67.52) v1(48.77,61.93) v1(48.77,61.42) v1(48.77,60.91) v1(48.77,50.12) v1(48.77,49.61) v1(48.77,49.1) v1(48.77,45.16) v1(48.77,44.66) v1(48.77,44.15) v1(48.9,118.7) v1(49.15,98.38) v1(49.28,97.49) v1(49.4,118.7) v1(49.66,98.38) v1(49.78,97.49) v1(50.29,97.49) v1(55.88,118.44) v1(56.39,118.44) v1(56.9,118.44) v2(20.53,124.94) v2(20.53,124.14) v2(20.53,123.34) v2(20.53,122.54) v2(21.33,124.94) v2(21.33,124.14) v2(21.33,122.54) v2(22.13,124.94) v2(22.13,124.14) v2(22.13,123.34) v2(22.13,122.54) v2(22.93,124.94) v2(22.93,124.14) v2(22.93,123.34) v2(22.93,122.54) v3(3.91,113.39) v3(4.65,113.39) v3(5.72,93.62) v3(6.46,93.62) v3(7.25,93.62) v3(31.21,124.9) v3(31.21,124.01)
VIN: length 135.7
  Top Layer w0.127: v4(39.81,24.56) 39.81,25.97 39.89,26.05 ; USB11.B4 v4(24.9,39.51) ; 39.89,86.05 39.81,85.97 v4(39.81,84.56) ; 39.9,42.55 39.81,42.64 v4(39.81,44.02) ; USB1.B4 v4(24.9,114.51) ; 37.39,11.05 v4(37.39,9.58) ; USB15.B9 v4(22.4,9.51) ; 22.4,12.48 22.48,12.56 v4(22.48,13.95) ; USB1.A4 22.48,117.56 v4(22.48,118.95) ; 39.9,117.55 39.81,117.64 v4(39.81,119.02) v1(39.81,120.56) v1(40.38,120.56) ; USB13.B4 v4(24.9,24.51) ; v4(39.81,99.56) 39.81,100.97 39.89,101.05 ; v4(39.81,69.56) 39.81,70.97 39.89,71.05 ; 39.89,116.05 39.81,115.97 v4(39.81,114.56) ; 39.9,57.55 39.81,57.64 v4(39.81,59.02) ; 22.48,103.95 22.48,102.56 22.4,102.48 ; 37.4,27.55 v4(37.4,29.02) ; 37.4,117.55 v4(37.4,119.02) ; 39.9,27.55 39.81,27.64 v4(39.81,29.02) ; USB9.A9 v4(24.89,58.95) ; v4(39.81,39.56) 39.81,40.97 39.89,41.05 ; 37.4,102.55 v4(37.4,104.02) ; 39.9,12.55 39.81,12.64 v4(39.81,14.02) ; USB3.A4 22.48,102.56 v4(22.48,103.95) ; USB13.B9 v4(22.4,24.51) ; USB11.A9 v4(24.89,43.95) ; v4(39.81,9.56) 39.81,10.97 39.89,11.05 ; USB7.A9 v4(24.89,73.95) ; 37.39,41.05 v4(37.39,39.58) ; USB15.B4 v4(24.9,9.51) ; USB7.A4 22.48,72.56 v4(22.48,73.95) ; v4(24.9,84.51) USB5.B4 ; 37.4,12.55 v4(37.4,14.02) ; USB1.B9 v4(22.4,114.51) ; v4(22.4,84.51) USB5.B9 ; v4(24.89,88.95) USB5.A9 ; v4(39.81,104.02) 39.81,102.64 39.9,102.55 ; USB9.A4 22.48,57.56 v4(22.48,58.95) ; 39.9,87.55 39.81,87.64 v4(39.81,89.02) ; 37.39,71.05 v4(37.39,69.58) ; v4(22.48,88.95) 22.48,87.56 USB5.A4 ; USB11.A4 22.48,42.56 v4(22.48,43.95) ; v4(39.81,74.02) 39.81,72.64 39.9,72.55 ; 37.4,57.55 v4(37.4,59.02) ; USB9.B9 v4(22.4,54.51) ; USB9.B4 v4(24.9,54.51) ; USB13.A4 22.48,27.56 v4(22.48,28.95) ; USB13.A9 v4(24.89,28.95) ; 37.4,72.55 v4(37.4,74.02) ; 37.4,42.55 v4(37.4,44.02) ; USB15.A9 v4(24.89,13.95) ; USB7.B9 v4(22.4,69.51) ; 37.4,87.55 v4(37.4,89.02) ; 39.89,56.05 39.81,55.97 v4(39.81,54.56) ; USB7.B4 v4(24.9,69.51) ; 37.39,116.05 v4(37.39,114.58) ; USB11.B9 v4(22.4,39.51) ; 37.39,86.05 v4(37.39,84.58) ; 37.39,56.05 v4(37.39,54.58) ; USB1.A9 v4(24.89,118.95) ; 37.39,101.05 v4(37.39,99.58) ; 37.39,26.05 v4(37.39,24.58) ; USB3.B9 v4(22.4,99.51) USB3.B9 ; USB3.B4 v4(24.9,99.51) USB3.B4 ; USB3.A9 v4(24.89,103.95) USB3.A9
  Top Layer w0.2: U3.1 5.46,92.11 5.46,91.01 6.1,90.38 6.31,90.38 ; 6.31,90.38 6.98,90.38 7.43,90.82 C9.2 8.24,90.77 8.24,90.26 8.38,90.12 9.19,90.12 9.19,90.12 9.27,90.12 9.87,89.52 v1(10.26,89.52) ; 6.31,90.38 D1.1 4.77,88.84 R23.2
  Bottom Layer w0.127: v1(41.53,123.52) 41.62,123.61 42.2,123.61 42.29,123.52 42.29,122.38 42.16,122.25 42.12,122.25 41.7,121.84 40.99,121.84 40.51,121.36 40.51,120.68 v1(40.38,120.56) ; v1(41.02,124.03) v1(40.51,124.03) v1(40.51,123.52) 39.88,122.89 39.88,120.62 v1(39.81,120.56) ; v1(41.02,124.03) 41.02,124.16 41.15,124.28 41.78,124.28 41.91,124.16 42.67,124.16 42.8,124.03 42.8,122.25 41.66,121.11 v1(41.66,120.56) ; v1(41.02,124.03) v1(41.53,124.03) ; v1(41.53,124.03) v1(41.02,123.52) ; v1(41.53,124.03) 42.42,124.03 42.54,123.9 42.54,122.38 41.28,121.11 41.15,121.11 41.06,121.02 41.06,120.59 v1(41.02,120.56)
  vias: v1(10.18,88.94) v1(10.83,89.4) v1(10.83,88.81) v1(15.49,62.18) v1(15.49,61.67) v1(15.75,106.76) v1(15.75,106.25) v1(15.88,66.25) v1(15.88,65.74) v1(15.88,65.23) v1(15.88,64.72) v1(15.88,51.01) v1(15.88,50.5) v1(15.88,49.99) v1(15.88,49.48) v1(15.88,35) v1(15.88,34.5) v1(15.88,33.99) v1(15.88,33.48) v1(16,79.33) v1(16,78.82) v1(16,78.31) v1(16,77.8) v1(16,62.18) v1(16,61.67) v1(16.13,109.93) v1(16.13,109.43) v1(16.13,108.92) v1(16.13,108.41) v1(16.13,94.82) v1(16.13,94.31) v1(16.13,93.81) v1(16.13,93.3) v1(16.26,106.76) v1(16.26,106.25) v1(16.26,97.74) v1(16.26,97.23) v1(16.38,66.25) v1(16.38,65.74) v1(16.38,65.23) v1(16.38,64.72) v1(16.38,51.01) v1(16.38,50.5) v1(16.38,49.99) v1(16.38,49.48) v1(16.38,35) v1(16.38,34.5) v1(16.38,33.99) v1(16.38,33.48) v1(16.51,79.33) v1(16.51,78.82) v1(16.51,78.31) v1(16.51,77.8) v1(16.51,62.18) v1(16.51,61.67) v1(16.64,109.93) v1(16.64,109.43) v1(16.64,108.92) v1(16.64,108.41) v1(16.64,94.82) v1(16.64,94.31) v1(16.64,93.81) v1(16.64,93.3) v1(16.76,106.76) v1(16.76,106.25) v1(16.76,97.74) v1(16.76,97.23) v1(16.89,66.25) v1(16.89,65.74) v1(16.89,65.23) v1(16.89,64.72) v1(16.89,51.01) v1(16.89,50.5) v1(16.89,49.99) v1(16.89,49.48) v1(16.89,35) v1(16.89,34.5) v1(16.89,33.99) v1(16.89,33.48) v1(17.02,79.33) v1(17.02,78.82) v1(17.02,78.31) v1(17.02,77.8) v1(17.15,109.93) v1(17.15,109.43) v1(17.15,108.92) v1(17.15,108.41) v1(17.15,94.82) v1(17.15,94.31) v1(17.15,93.81) v1(17.15,93.3) v1(17.27,97.74) v1(17.27,97.23) v1(22.22,66.25) v1(22.22,65.74) v1(22.22,65.23) v1(22.22,64.72) v1(22.22,51.01) v1(22.22,50.5) v1(22.22,49.99) v1(22.22,49.48) v1(22.22,35) v1(22.22,34.5) v1(22.22,33.99) v1(22.22,33.48) v1(22.35,79.33) v1(22.35,78.82) v1(22.35,78.31) v1(22.35,77.8) v1(22.48,109.93) v1(22.48,109.43) v1(22.48,108.92) v1(22.48,108.41) v1(22.48,94.82) v1(22.48,94.31) v1(22.48,93.81) v1(22.48,93.3) v1(22.73,66.25) v1(22.73,65.74) v1(22.73,65.23) v1(22.73,64.72) v1(22.73,51.01) v1(22.73,50.5) v1(22.73,49.99) v1(22.73,49.48) v1(22.73,35) v1(22.73,34.5) v1(22.73,33.99) v1(22.73,33.48) v1(22.86,79.33) v1(22.86,78.82) v1(22.86,78.31) v1(22.86,77.8) v1(22.99,109.93) v1(22.99,109.43) v1(22.99,108.92) v1(22.99,108.41) v1(22.99,94.82) v1(22.99,94.31) v1(22.99,93.81) v1(22.99,93.3) v1(23.24,66.25) v1(23.24,65.74) v1(23.24,65.23) v1(23.24,64.72) v1(23.24,51.01) v1(23.24,50.5) v1(23.24,49.99) v1(23.24,49.48) v1(23.24,35) v1(23.24,34.5) v1(23.24,33.99) v1(23.24,33.48) v1(23.37,79.33) v1(23.37,78.82) v1(23.37,78.31) v1(23.37,77.8) v1(23.5,109.93) v1(23.5,109.43) v1(23.5,108.92) v1(23.5,108.41) v1(23.5,94.82) v1(23.5,94.31) v1(23.5,93.81) v1(23.5,93.3) v1(41.66,77.8) v1(41.66,77.3) v1(41.66,76.79) v1(41.66,76.28) v1(41.66,65.74) v1(41.66,65.23) v1(41.66,64.72) v1(41.66,64.21) v1(41.91,107.9) v1(41.91,107.39) v1(41.91,106.89) v1(41.91,106.38) v1(41.91,95.33) v1(41.91,94.82) v1(41.91,94.31) v1(41.91,93.81) v1(42.16,77.8) v1(42.16,77.3) v1(42.16,76.79) v1(42.16,76.28) v1(42.16,65.74) v1(42.16,65.23) v1(42.16,64.72) v1(42.16,64.21) v1(42.42,107.9) v1(42.42,107.39) v1(42.42,106.89) v1(42.42,106.38) v1(42.42,95.33) v1(42.42,94.82) v1(42.42,94.31) v1(42.42,93.81) v1(42.54,35.38) v1(42.54,34.88) v1(42.54,34.37) v1(42.54,33.86) v1(42.67,77.8) v1(42.67,77.3) v1(42.67,76.79) v1(42.67,76.28) v1(42.67,65.74) v1(42.67,65.23) v1(42.67,64.72) v1(42.67,64.21) v1(42.93,107.9) v1(42.93,107.39) v1(42.93,106.89) v1(42.93,106.38) v1(42.93,95.33) v1(42.93,94.82) v1(42.93,94.31) v1(42.93,93.81) v1(43.05,35.38) v1(43.05,34.88) v1(43.05,34.37) v1(43.05,33.86) v1(43.31,53.04) v1(43.31,52.53) v1(43.31,52.02) v1(43.31,51.51) v1(43.56,35.38) v1(43.56,34.88) v1(43.56,34.37) v1(43.56,33.86) v1(43.56,22.94) v1(43.56,22.43) v1(43.56,21.92) v1(43.56,21.41) v1(43.81,53.04) v1(43.81,52.53) v1(43.81,52.02) v1(43.81,51.51) v1(44.07,22.94) v1(44.07,22.43) v1(44.07,21.92) v1(44.07,21.41) v1(44.32,53.04) v1(44.32,52.53) v1(44.32,52.02) v1(44.32,51.51) v1(44.58,22.94) v1(44.58,22.43) v1(44.58,21.92) v1(44.58,21.41) v1(47.88,53.67) v1(47.88,53.17) v1(47.88,52.66) v1(47.88,52.15) v1(48.01,77.8) v1(48.01,77.3) v1(48.01,76.79) v1(48.01,76.28) v1(48.26,106.12) v1(48.26,105.62) v1(48.26,105.11) v1(48.26,104.6) v1(48.26,95.33) v1(48.26,94.82) v1(48.26,94.31) v1(48.26,93.81) v1(48.77,106.12) v1(48.77,105.62) v1(48.77,105.11) v1(48.77,104.6) v1(48.77,95.33) v1(48.77,94.82) v1(48.77,94.31) v1(48.77,93.81) v1(48.9,35.38) v1(48.9,34.88) v1(48.9,34.37) v1(48.9,33.86) v1(49.28,106.12) v1(49.28,105.62) v1(49.28,105.11) v1(49.28,104.6) v1(49.28,95.33) v1(49.28,94.82) v1(49.28,94.31) v1(49.28,93.81) v1(49.4,35.38) v1(49.4,34.88) v1(49.4,34.37) v1(49.4,33.86) v1(49.91,35.38) v1(49.91,34.88) v1(49.91,34.37) v1(49.91,33.86) v1(49.91,22.94) v1(49.91,22.43) v1(49.91,21.92) v1(49.91,21.41) v1(50.42,22.94) v1(50.42,22.43) v1(50.42,21.92) v1(50.42,21.41) v1(50.93,22.94) v1(50.93,22.43) v1(50.93,21.92) v1(50.93,21.41)
BOOT: length 1.6
  Top Layer w0.127: 6.04,96.67 6.04,96.16 5.97,96.09 5.97,95.13 U3.9
BOOT0: length 31.3
  Top Layer w0.127: U4.31 20.45,126.27 20.45,127.33 20.32,127.46 v1(19.68,127.46) 21.45,129.24 24.18,129.24 24.53,129.59 24.88,129.59 25,129.47 34.96,129.47 35.43,129 35.43,128.99 35.47,128.96 42.8,128.96 43.33,129.49 v1(44.32,129.49)
  Bottom Layer w0.127: v1(44.32,129.49) 44.62,129.19 45.51,129.19 45.85,128.86 46.1,128.86 46.19,128.77 46.19,127.68 NOREF#10.1
CAN_H: length 627.8
  Top Layer w0.127: v1(29.97,41.5) 30.35,41.88 32.77,41.88 33.12,41.53 v1(33.37,41.53) 33.64,41.53 33.79,41.38 34.03,41.38 34.29,41.12 34.29,40.9 34.35,40.84 34.35,39.61 34.99,38.97 35.46,38.97 35.79,38.64 36.59,38.64 36.94,39 38.21,39 38.45,39.24 38.27,39.43 v1(38.27,39.58) 38.27,40.92 38.39,41.05 ; v1(28.92,115.88) 28.65,115.88 28.5,116.02 28.37,116.02 28.28,115.93 28.28,115.71 28.22,115.65 28.22,114.42 27.76,113.96 27.76,113.79 28.36,113.19 28.36,112.83 28.1,112.58 27.86,112.58 27.72,112.44 v1(27.4,112.44) ; USB7.B7 23.27,70.85 v1(23.27,69.51) 23.27,69.36 23.51,69.12 23.51,68.88 23.76,68.62 25.33,68.62 25.52,68.43 26.57,68.43 26.76,68.62 27.42,68.62 28.22,69.42 28.22,70.65 28.28,70.71 28.28,70.93 28.37,71.02 28.5,71.02 28.65,70.88 v1(28.92,70.88) ; v1(29.97,72.61) 30.32,72.26 32.64,72.26 33.06,72.68 v1(33.37,72.68) 33.64,72.68 33.79,72.53 33.92,72.53 34.01,72.62 34.01,73.7 34.23,73.92 34.61,73.92 35.05,74.36 35.05,74.42 35.72,75.1 35.79,75.1 35.88,75.19 36.24,75.19 36.34,75.1 36.77,75.1 36.96,74.91 38.53,74.91 38.78,74.65 38.78,74.41 39.02,74.17 v1(39.02,74.02) 39.02,72.68 38.9,72.55 ; 38.39,71.05 38.27,70.92 v1(38.27,69.58) 38.27,69.43 38.45,69.24 38.21,69 36.94,69 36.59,68.64 35.79,68.64 35.46,68.97 34.98,68.97 34.35,69.61 34.35,70.84 34.29,70.9 34.29,71.12 34.03,71.38 33.79,71.38 33.64,71.53 v1(33.37,71.53) 33.12,71.53 32.77,71.88 30.35,71.88 v1(29.97,71.5) ; 23.76,98.62 23.51,98.88 23.51,99.12 23.27,99.36 23.27,100.85 USB3.B7 23.27,100.85 v1(23.27,99.51) 23.27,99.36 23.51,99.12 23.51,98.88 23.76,98.62 ; 23.76,98.62 25.33,98.62 25.52,98.43 ; v1(29.97,57.61) 30.32,57.26 32.64,57.26 33.06,57.68 v1(33.37,57.68) 33.64,57.68 33.79,57.53 33.92,57.53 34.01,57.62 34.01,58.7 34.23,58.92 34.62,58.92 35.05,59.36 35.05,59.42 35.72,60.1 35.79,60.1 35.89,60.19 36.24,60.19 36.34,60.1 36.77,60.1 36.96,59.91 38.53,59.91 38.79,59.65 38.79,59.41 39.02,59.17 v1(39.02,59.02) 39.02,57.68 38.9,57.55 ; 25.52,98.43 26.57,98.43 ; 25.52,98.43 25.33,98.62 ; 26.57,98.43 26.76,98.62 27.42,98.62 28.22,99.42 ; 26.57,98.43 26.76,98.62 ; 38.9,117.55 39.02,117.68 v1(39.02,119.02) 39.02,119.17 38.79,119.41 38.79,119.65 38.53,119.91 36.96,119.91 36.77,120.1 36.34,120.1 36.24,120.19 35.89,120.19 35.79,120.1 35.72,120.1 35.05,119.42 35.05,119.36 34.62,118.92 34.23,118.92 34.01,118.7 34.01,117.62 33.92,117.53 33.79,117.53 33.64,117.68 v1(33.37,117.68) ; 23.78,104.34 23.78,104.47 ; 23.78,104.34 24.02,104.1 v1(24.02,103.95) 24.02,102.61 USB3.A7 24.02,102.61 24.02,104.1 23.78,104.34 ; 23.78,104.34 23.78,104.47 ; 23.78,104.47 23.87,104.56 ; 23.78,104.47 23.87,104.56 25.45,104.56 25.64,104.74 ; USB15.B7 23.27,10.85 v1(23.27,9.51) 23.27,9.36 23.51,9.12 23.51,8.88 23.76,8.62 25.33,8.62 25.52,8.43 26.57,8.43 26.76,8.62 27.42,8.62 28.22,9.42 28.22,10.65 28.28,10.71 28.28,10.93 28.37,11.02 28.5,11.02 28.65,10.88 v1(28.93,10.88) ; v1(33.37,11.53) 33.64,11.53 33.79,11.38 34.03,11.38 34.29,11.12 34.29,10.9 34.35,10.84 34.35,9.61 34.99,8.97 35.46,8.97 35.79,8.64 36.59,8.64 36.94,9 38.21,9 38.45,9.24 38.27,9.43 v1(38.27,9.58) 38.27,10.92 38.39,11.05 ; 32.26,124.85 32.52,124.59 33.98,124.59 34.16,124.41 34.16,120.98 v1(34.29,120.86) ; USB11.B7 23.27,40.85 v1(23.27,39.51) 23.27,39.36 23.51,39.12 23.51,38.88 23.76,38.62 25.33,38.62 25.52,38.43 26.57,38.43 26.76,38.62 27.42,38.62 28.22,39.42 28.22,40.65 28.28,40.71 28.28,40.93 28.37,41.02 28.5,41.02 28.65,40.88 v1(28.92,40.88) ; v1(29.97,87.61) 30.32,87.26 32.64,87.26 33.06,87.68 v1(33.37,87.68) 33.64,87.68 33.79,87.53 33.92,87.53 34.01,87.62 34.01,88.7 34.23,88.92 34.62,88.92 35.05,89.36 35.05,89.42 35.72,90.1 35.79,90.1 35.89,90.19 36.24,90.19 36.34,90.1 36.77,90.1 36.96,89.91 38.53,89.91 38.79,89.65 38.79,89.41 39.02,89.17 v1(39.02,89.02) 39.02,87.68 38.9,87.55 ; SW2.2 54.74,18.01 54.65,18.1 54.4,18.1 54.15,18.35 51.64,18.35 v1(50.53,17.24) ; 28.22,99.42 28.22,100.65 ; 28.22,99.42 28.22,100.65 ; 28.22,99.42 27.42,98.62 ; 28.22,100.65 28.28,100.71 28.28,100.93 28.37,101.02 ; 28.22,100.65 28.28,100.71 28.28,100.93 28.37,101.02 28.5,101.02 ; 28.5,101.02 28.65,100.88 v1(28.92,100.88) ; 28.5,101.02 28.65,100.88 ; 28.25,102.18 28,102.43 28,103.51 27.94,103.57 ; v1(28.92,102.03) 28.65,102.03 28.5,102.18 ; 26.96,104.17 27.56,103.57 27.94,103.57 ; 26.96,104.17 26.96,104.24 ; 26.96,104.17 27.56,103.57 ; 26.96,104.17 26.96,104.24 ; 26.29,104.84 26.39,104.74 26.45,104.74 26.96,104.24 ; v1(28.92,117.03) 28.65,117.03 28.5,117.18 28.25,117.18 28,117.43 28,118.5 27.87,118.63 27.5,118.63 26.96,119.17 26.96,119.24 26.45,119.74 26.38,119.74 26.29,119.84 26.16,119.84 26.07,119.74 25.64,119.74 25.45,119.56 23.87,119.56 23.78,119.47 23.78,119.34 24.02,119.1 v1(24.02,118.95) 24.02,117.61 USB1.A7 ; 26.45,104.74 26.96,104.24 ; 26.16,104.84 26.29,104.84 26.38,104.74 ; 26.16,104.84 26.07,104.74 ; 26.16,104.84 26.07,104.74 ; 25.64,104.74 26.07,104.74 ; 25.64,104.74 25.45,104.56 ; USB11.A7 24.02,42.61 v1(24.02,43.95) 24.02,44.1 23.78,44.34 23.78,44.47 23.87,44.56 25.45,44.56 25.64,44.74 26.07,44.74 26.16,44.84 26.29,44.84 26.38,44.74 26.45,44.74 26.96,44.24 26.96,44.17 27.56,43.57 27.94,43.57 28,43.51 28,42.43 28.25,42.18 28.5,42.18 28.65,42.03 v1(28.92,42.03) ; v1(29.97,42.61) 30.32,42.26 32.64,42.26 33.06,42.68 v1(33.37,42.68) 33.64,42.68 33.79,42.53 33.92,42.53 34.01,42.62 34.01,43.7 34.23,43.92 34.62,43.92 35.05,44.36 35.05,44.42 35.72,45.1 35.79,45.1 35.89,45.19 36.24,45.19 36.34,45.1 36.77,45.1 36.96,44.91 38.53,44.91 38.79,44.65 38.79,44.41 39.02,44.17 v1(39.02,44.02) 39.02,42.68 38.9,42.55 ; 28.5,102.18 28.26,102.18 28,102.43 28,103.51 27.94,103.57 ; 28.5,102.18 28.65,102.03 ; 33.37,116.53 33.12,116.53 32.77,116.88 30.35,116.88 v1(29.97,116.5) ; v1(29.97,86.5) 30.35,86.88 32.77,86.88 33.12,86.53 v1(33.37,86.53) 33.64,86.53 33.79,86.38 34.03,86.38 34.29,86.12 34.29,85.9 34.35,85.84 34.35,84.61 34.99,83.97 35.46,83.97 35.79,83.64 36.59,83.64 36.94,84 38.21,84 38.45,84.24 38.27,84.43 v1(38.27,84.58) 38.27,85.92 38.39,86.05 ; USB9.A7 24.02,57.61 v1(24.02,58.95) 24.02,59.1 23.78,59.34 23.78,59.47 23.87,59.56 25.45,59.56 25.64,59.74 26.07,59.74 26.16,59.84 26.29,59.84 26.38,59.74 26.45,59.74 26.96,59.24 26.96,59.17 27.56,58.57 27.94,58.57 28,58.51 28,57.43 28.25,57.18 28.5,57.18 28.65,57.03 v1(28.92,57.03) ; USB1.B7 23.27,115.85 v1(23.27,114.51) 23.27,114.36 23.51,114.12 23.51,113.88 23.76,113.62 25.33,113.62 25.62,113.33 25.62,113.31 v1(25.47,113.16) ; v1(28.92,85.88) 28.65,85.88 28.5,86.02 28.37,86.02 28.28,85.93 28.28,85.71 28.22,85.65 28.22,84.42 27.42,83.62 26.76,83.62 26.57,83.43 25.52,83.43 25.33,83.62 23.76,83.62 23.51,83.88 23.51,84.12 23.27,84.36 v1(23.27,84.51) 23.27,85.85 USB5.B7 ; USB5.A7 24.02,87.61 v1(24.02,88.95) 24.02,89.1 23.78,89.34 23.78,89.47 23.87,89.56 25.45,89.56 25.64,89.74 26.07,89.74 26.16,89.84 26.29,89.84 26.38,89.74 26.45,89.74 26.96,89.24 26.96,89.17 27.56,88.57 27.94,88.57 28,88.51 28,87.43 28.25,87.18 28.5,87.18 28.65,87.03 v1(28.92,87.03) ; v1(29.97,27.61) 30.32,27.26 32.64,27.26 33.06,27.68 v1(33.37,27.68) 33.64,27.68 33.79,27.53 33.92,27.53 34.01,27.62 34.01,28.7 34.23,28.92 34.62,28.92 35.05,29.36 35.05,29.43 35.72,30.1 35.79,30.1 35.89,30.19 36.24,30.19 36.34,30.1 36.77,30.1 36.96,29.91 38.53,29.91 38.79,29.65 38.79,29.41 39.02,29.17 v1(39.02,29.02) 39.02,27.68 38.9,27.55 ; USB13.A7 24.02,27.61 v1(24.02,28.95) 24.02,29.1 23.78,29.34 23.78,29.47 23.87,29.56 25.45,29.56 25.64,29.74 26.07,29.74 26.16,29.84 26.29,29.84 26.38,29.74 26.45,29.74 26.96,29.24 26.96,29.17 27.56,28.57 27.94,28.57 28,28.51 28,27.43 28.25,27.18 28.5,27.18 28.65,27.03 v1(28.92,27.03) ; USB13.B7 23.27,25.85 v1(23.27,24.51) 23.27,24.36 23.51,24.12 23.51,23.88 23.76,23.62 25.33,23.62 25.52,23.43 26.57,23.43 26.76,23.62 27.42,23.62 28.22,24.42 28.22,25.65 28.28,25.71 28.28,25.93 28.37,26.02 28.5,26.02 28.65,25.88 v1(28.92,25.88) ; 38.9,102.55 39.02,102.68 v1(39.02,104.02) 39.02,104.17 38.79,104.41 38.79,104.65 38.53,104.91 36.96,104.91 36.77,105.1 36.34,105.1 36.24,105.19 35.89,105.19 35.79,105.1 35.72,105.1 35.05,104.42 35.05,104.36 34.62,103.92 34.23,103.92 34.01,103.7 34.01,102.62 33.92,102.53 33.79,102.53 33.64,102.68 v1(33.37,102.68) 33.07,102.68 32.64,102.26 30.32,102.26 v1(29.97,102.61) ; USB15.A7 24.02,12.61 v1(24.02,13.95) 24.02,14.1 23.78,14.34 23.78,14.47 23.87,14.56 25.45,14.56 25.64,14.74 26.07,14.74 26.16,14.84 26.29,14.84 26.39,14.74 26.45,14.74 26.96,14.24 26.96,14.17 27.56,13.57 27.94,13.57 28,13.51 28,12.43 28.26,12.18 28.5,12.18 28.65,12.03 v1(28.93,12.03) ; 38.39,101.05 38.27,100.92 v1(38.27,99.58) 38.27,99.43 38.45,99.24 38.21,99 36.94,99 36.59,98.64 35.79,98.64 35.46,98.97 34.99,98.97 34.35,99.61 34.35,100.84 34.29,100.9 34.29,101.12 34.03,101.38 33.79,101.38 33.64,101.53 v1(33.37,101.53) 33.12,101.53 32.77,101.88 30.35,101.88 v1(29.97,101.5) ; v1(30.09,117.6) 30.44,117.26 32.64,117.26 33.06,117.68 33.37,117.68 ; v1(29.97,26.5) 30.35,26.88 32.77,26.88 33.12,26.53 v1(33.37,26.53) 33.64,26.53 33.79,26.38 34.03,26.38 34.29,26.12 34.29,25.9 34.35,25.84 34.35,24.61 34.99,23.97 35.46,23.97 35.79,23.64 36.59,23.64 36.94,24 38.21,24 38.45,24.24 38.27,24.43 v1(38.27,24.58) 38.27,25.92 38.39,26.05 ; USB9.B7 23.27,55.85 v1(23.27,54.51) 23.27,54.36 23.51,54.12 23.51,53.88 23.76,53.62 25.33,53.62 25.52,53.43 26.57,53.43 26.76,53.62 27.42,53.62 28.22,54.42 28.22,55.65 28.28,55.71 28.28,55.93 28.37,56.02 28.5,56.02 28.65,55.88 v1(28.92,55.88) ; SW1.2 54.48,111.36 54.39,111.44 54.15,111.44 54.02,111.57 51.59,111.57 v1(50.48,110.46) ; v1(33.37,116.53) 33.64,116.53 33.79,116.38 34.03,116.38 34.29,116.12 34.29,115.9 34.35,115.84 34.35,114.61 34.99,113.97 35.46,113.97 35.79,113.64 36.59,113.64 36.94,114 38.21,114 38.45,114.24 38.27,114.43 v1(38.27,114.58) 38.27,115.92 38.39,116.05 ; 38.39,56.05 38.27,55.92 v1(38.27,54.58) 38.27,54.43 38.45,54.24 38.21,54 36.94,54 36.59,53.64 35.79,53.64 35.46,53.97 34.99,53.97 34.35,54.61 34.35,55.84 34.29,55.9 34.29,56.12 34.03,56.38 33.79,56.38 33.64,56.53 v1(33.37,56.53) 33.12,56.53 32.77,56.88 30.35,56.88 v1(29.97,56.5) ; v1(33.37,12.68) 33.64,12.68 33.79,12.53 33.92,12.53 34.01,12.62 34.01,13.7 34.23,13.92 34.55,13.92 35.72,15.1 35.79,15.1 35.89,15.19 36.24,15.19 36.34,15.1 36.77,15.1 36.96,14.91 38.53,14.91 38.79,14.65 38.79,14.41 39.02,14.17 v1(39.02,14.02) 39.02,12.68 38.9,12.55 ; v1(28.92,72.03) 28.65,72.03 28.5,72.18 28.25,72.18 28,72.43 28,73.51 27.94,73.57 27.56,73.57 26.96,74.17 26.96,74.24 26.45,74.74 26.38,74.74 26.29,74.84 26.16,74.84 26.07,74.74 25.64,74.74 25.45,74.56 23.87,74.56 23.78,74.47 23.78,74.34 24.02,74.1 v1(24.02,73.95) 24.02,72.61 USB7.A7
  Bottom Layer w0.127: v1(50.53,17.24) 48.65,17.24 47.54,18.35 33.4,18.35 ; v1(29.97,71.5) 29.35,70.88 ; 29.35,70.88 v1(28.92,70.88) ; 29.35,70.88 31.26,70.88 ; 34.28,120.21 34.29,120.22 v1(34.29,120.86) ; 34.28,120.21 31.6,120.21 31.34,119.96 31.34,27.04 ; 34.28,120.21 34.35,120.14 53.04,120.14 54.01,119.17 54.01,111.83 53.76,111.57 53.52,111.57 52.41,110.46 50.53,110.46 ; v1(29.97,87.61) 29.5,87.61 29.34,87.45 29.34,87.44 29.1,87.19 ; 31.75,18.35 31.34,18.76 31.34,25.79 ; 31.75,18.35 31.88,18.23 31.88,14.98 29.34,12.45 29.34,12.44 29.1,12.19 29.09,12.19 v1(28.93,12.03) ; 31.75,18.35 32.47,18.35 ; 31.34,27.04 31.34,25.79 ; 31.34,27.04 31.33,27.03 v1(28.92,27.03) 29.09,27.19 29.1,27.19 29.34,27.44 29.34,27.45 29.5,27.61 v1(29.97,27.61) ; 31.34,25.79 31.26,25.88 29.35,25.88 ; v1(27.4,112.44) 27.4,112.48 27.31,112.58 26.88,112.58 26.81,112.5 26.45,112.5 26.28,112.68 25.96,112.68 v1(25.47,113.16) ; 29.35,85.88 v1(28.92,85.88) ; 29.35,85.88 v1(29.97,86.5) ; 29.35,85.88 31.26,85.88 ; 29.35,55.88 31.26,55.88 ; 29.35,55.88 v1(28.92,55.88) ; 29.35,55.88 v1(29.97,56.5) ; v1(29.97,101.5) 29.35,100.88 ; 29.35,100.88 v1(28.93,100.88) ; 29.35,100.88 31.26,100.88 ; 32.92,18.35 33.4,18.35 ; 32.92,18.35 32.89,18.32 32.89,14.43 32,13.54 32,11.65 32.13,11.53 v1(33.37,11.53) ; 32.92,18.35 32.47,18.35 ; 33.4,18.35 33.37,18.32 v1(33.37,12.68) ; v1(29.97,57.61) 29.5,57.61 29.34,57.45 29.34,57.44 29.1,57.19 ; 29.35,25.88 v1(28.92,25.88) ; 29.35,25.88 v1(29.97,26.5) ; 29.35,117.03 31.33,117.03 ; 29.35,117.03 v1(28.92,117.03) ; 29.35,117.03 29.59,116.79 29.59,116.16 29.31,115.88 v1(28.92,115.88) ; v1(29.97,116.5) 29.35,115.88 31.26,115.88 ; 29.35,40.88 v1(28.92,40.88) ; 29.35,40.88 v1(29.97,41.5) ; 29.35,40.88 31.26,40.88 ; 32.47,18.35 32.47,14.42 29.34,11.29 29.34,11.28 29.1,11.04 29.09,11.04 v1(28.93,10.88) ; 29.1,117.19 29.34,117.44 29.34,117.45 29.5,117.6 v1(30.09,117.6) ; v1(28.92,42.03) 31.33,42.03 ; v1(28.92,72.03) 31.33,72.03 ; v1(28.92,57.03) 31.33,57.03 ; 29.1,102.19 29.34,102.44 29.34,102.45 29.51,102.61 v1(29.97,102.61) ; v1(28.93,102.03) 31.33,102.03 ; 29.1,72.19 29.34,72.44 29.34,72.45 29.5,72.61 v1(29.97,72.61) ; 29.1,42.19 29.34,42.44 29.34,42.45 29.5,42.61 v1(29.97,42.61) ; v1(28.92,87.03) 31.33,87.03
CAN_L: length 622.3
  Top Layer w0.127: 28.5,101.3 28.65,101.45 v1(28.92,101.45) 29.21,101.45 29.8,100.86 32,100.86 32.39,101.24 v1(32.39,101.37) ; 28.5,101.3 28.26,101.3 28,101.05 28,100.83 27.94,100.76 ; 28.5,101.3 28.65,101.45 ; 38.89,11.05 39.02,10.92 v1(39.02,9.58) 39.02,9.43 38.78,9.19 38.78,8.95 38.53,8.69 37.03,8.69 36.7,8.36 35.67,8.36 35.34,8.69 34.87,8.69 34.07,9.49 34.07,10.72 34.01,10.78 34.01,11.01 33.92,11.1 33.79,11.1 33.64,10.95 v1(33.37,10.95) 32.44,10.95 32.13,11.25 32.13,14.05 32.51,14.43 32.51,18.88 v1(32.26,19.13) ; v1(33.78,119.59) 33.87,119.68 33.87,124.02 33.78,124.11 32.35,124.11 32.26,124.2 ; 32.39,117.64 32,118.02 30.15,118.02 30.14,118.03 29.79,118.03 29.79,118.02 29.33,118.02 29,117.68 ; 23.79,98.99 23.88,98.9 ; 23.79,98.99 23.79,99.12 ; 23.79,98.99 23.79,99.12 ; 23.79,98.99 23.88,98.9 ; 23.88,98.9 25.45,98.9 25.64,98.71 ; 29,117.68 29.46,117.68 29.55,117.59 29.55,116.79 29.46,116.7 29.18,116.7 29.1,116.62 29.09,116.62 v1(28.92,116.45) ; 29,117.68 v1(28.92,117.61) 28.65,117.61 28.5,117.46 28.37,117.46 28.28,117.55 28.28,118.62 28.08,118.82 28.07,118.82 27.99,118.91 27.62,118.91 27.24,119.28 27.24,119.35 26.57,120.02 26.5,120.02 26.4,120.12 26.05,120.12 25.95,120.02 25.52,120.02 25.33,119.83 23.76,119.83 23.5,119.58 23.5,119.34 23.27,119.1 v1(23.27,118.95) 23.27,117.61 USB1.A6 ; v1(32.38,26.37) 32.38,26.24 32,25.86 29.8,25.86 29.21,26.45 v1(28.92,26.45) 28.65,26.45 28.5,26.3 28.25,26.3 28,26.05 28,25.83 27.94,25.76 27.94,24.54 27.3,23.9 26.64,23.9 26.45,23.71 25.64,23.71 25.45,23.9 23.88,23.9 23.79,23.99 23.79,24.12 24.02,24.36 v1(24.02,24.51) 24.02,25.85 USB13.B6 ; 27.94,100.76 28,100.83 28,101.05 28.25,101.3 ; 27.94,100.76 27.94,99.54 ; 27.94,100.76 27.94,99.54 ; USB5.B6 24.02,85.85 v1(24.02,84.51) 24.02,84.36 23.79,84.12 23.79,83.99 23.88,83.9 25.45,83.9 25.64,83.71 26.45,83.71 26.64,83.9 27.3,83.9 27.94,84.54 27.94,85.76 28,85.83 28,86.05 28.25,86.3 28.5,86.3 28.65,86.45 v1(28.92,86.45) 29.21,86.45 29.8,85.86 32,85.86 32.38,86.24 v1(32.38,86.37) ; v1(32.26,19.13) 32.26,14.79 29.34,11.87 29.34,11.86 29.1,11.62 29.09,11.62 v1(28.93,11.45) 28.65,11.45 28.5,11.3 28.26,11.3 28,11.05 28,10.83 27.94,10.76 27.94,9.54 27.31,8.9 26.64,8.9 26.45,8.71 25.64,8.71 25.45,8.9 23.88,8.9 23.79,8.99 23.79,9.12 24.02,9.36 v1(24.02,9.51) 24.02,10.85 USB15.B6 ; v1(32.26,19.13) 32,19.13 31.88,19 31.88,15.56 v1(28.93,12.61) 28.65,12.61 28.5,12.46 28.37,12.46 28.28,12.55 28.28,13.62 28.06,13.85 27.68,13.85 27.24,14.28 27.24,14.35 26.57,15.02 26.5,15.02 26.41,15.12 26.05,15.12 25.95,15.02 25.52,15.02 25.33,14.83 23.76,14.83 23.5,14.58 23.5,14.34 23.27,14.1 v1(23.27,13.95) 23.27,12.61 23.4,12.48 ; v1(32.26,19.13) 32.35,19.22 32.93,19.22 33.02,19.13 33.02,14.18 32.64,13.79 32.64,12.14 32.68,12.1 v1(33.37,12.1) 33.64,12.1 33.79,12.25 34.03,12.25 34.29,12.51 34.29,13.58 34.35,13.64 34.66,13.64 35.84,14.82 35.91,14.82 36,14.91 36.13,14.91 36.22,14.82 36.65,14.82 36.84,14.63 38.42,14.63 38.51,14.54 38.51,14.41 38.27,14.17 v1(38.27,14.02) 38.27,12.68 38.4,12.55 ; USB11.B6 24.02,40.85 v1(24.02,39.51) 24.02,39.36 23.79,39.12 23.79,38.99 23.88,38.9 25.45,38.9 25.64,38.71 26.45,38.71 26.64,38.9 27.31,38.9 27.94,39.54 27.94,40.76 28,40.83 28,41.05 28.25,41.3 28.5,41.3 28.65,41.45 v1(28.92,41.45) 29.21,41.45 29.8,40.86 32,40.86 32.39,41.24 v1(32.39,41.37) ; 32.39,57.64 32,58.02 30.15,58.02 30.14,58.03 29.79,58.03 29.79,58.02 29.33,58.02 v1(28.92,57.61) 28.65,57.61 28.5,57.46 28.37,57.46 28.28,57.55 28.28,58.62 28.06,58.85 27.68,58.85 27.24,59.28 27.24,59.35 26.57,60.02 26.5,60.02 26.41,60.12 26.05,60.12 25.95,60.02 25.52,60.02 25.33,59.83 23.76,59.83 23.5,59.58 23.5,59.34 23.27,59.1 v1(23.27,58.95) 23.27,57.61 USB9.A6 ; 38.4,27.55 38.27,27.68 v1(38.27,29.02) 38.27,29.17 38.51,29.41 38.51,29.54 38.42,29.63 36.84,29.63 36.65,29.82 36.22,29.82 36.13,29.91 36,29.91 35.91,29.82 35.84,29.82 35.33,29.31 35.33,29.24 34.73,28.64 34.35,28.64 34.29,28.58 34.29,27.51 34.03,27.25 33.79,27.25 33.64,27.1 v1(33.37,27.1) ; 28.5,102.46 28.37,102.46 28.28,102.55 28.28,103.62 28.06,103.85 ; 28.5,102.46 28.65,102.61 ; 28.5,102.46 28.65,102.61 v1(28.92,102.61) 29.33,103.02 29.79,103.02 29.8,103.03 30.14,103.03 30.15,103.02 32,103.02 32.39,102.64 ; 26.05,105.12 25.95,105.02 25.52,105.02 ; v1(33.37,72.1) 33.64,72.1 33.79,72.25 34.03,72.25 34.29,72.51 34.29,73.58 34.35,73.64 34.73,73.64 35.33,74.24 35.33,74.31 35.84,74.82 35.9,74.82 36,74.91 36.13,74.91 36.22,74.82 36.65,74.82 36.84,74.63 38.42,74.63 38.51,74.54 38.51,74.41 38.27,74.17 v1(38.27,74.02) 38.27,72.68 38.4,72.55 ; 27.67,103.85 27.24,104.28 27.24,104.35 26.57,105.02 ; v1(33.37,70.95) 33.64,70.95 33.79,71.1 33.92,71.1 34.01,71.01 34.01,70.78 34.07,70.72 34.07,69.49 34.87,68.69 35.34,68.69 35.67,68.36 36.7,68.36 37.03,68.69 38.53,68.69 38.78,68.95 38.78,69.19 39.02,69.43 v1(39.02,69.58) 39.02,70.92 38.89,71.05 ; 23.79,99.12 24.02,99.36 v1(24.02,99.51) 24.02,100.85 USB3.B6 24.02,100.85 24.02,99.36 23.79,99.12 ; 38.4,42.55 38.27,42.68 v1(38.27,44.02) 38.27,44.17 38.51,44.41 38.51,44.54 38.42,44.63 36.84,44.63 36.65,44.82 36.22,44.82 36.13,44.91 36,44.91 35.91,44.82 35.84,44.82 35.33,44.31 35.33,44.24 34.73,43.64 34.35,43.64 34.29,43.58 34.29,42.51 34.03,42.25 33.79,42.25 33.64,42.1 v1(33.37,42.1) ; v1(33.37,100.95) 33.64,100.95 33.79,101.1 33.92,101.1 34.01,101.01 34.01,100.78 34.07,100.72 34.07,99.49 34.87,98.69 35.34,98.69 35.67,98.36 36.7,98.36 37.03,98.69 38.53,98.69 38.78,98.95 38.78,99.19 39.02,99.43 v1(39.02,99.58) 39.02,100.92 38.89,101.05 ; 28.37,102.46 28.28,102.55 28.28,103.62 28.06,103.85 ; 38.4,117.55 38.27,117.68 v1(38.27,119.02) 38.27,119.17 38.51,119.41 38.51,119.54 38.42,119.63 36.84,119.63 36.65,119.82 36.22,119.82 36.13,119.91 36,119.91 35.91,119.82 35.84,119.82 35.33,119.31 35.33,119.24 34.73,118.64 34.35,118.64 34.29,118.58 34.29,117.51 34.03,117.25 33.79,117.25 33.64,117.1 v1(33.37,117.1) ; v1(33.37,25.95) 33.64,25.95 33.79,26.1 33.92,26.1 34.01,26.01 34.01,25.78 34.07,25.72 34.07,24.49 34.87,23.69 35.34,23.69 35.67,23.36 36.7,23.36 37.03,23.69 38.53,23.69 38.78,23.95 38.78,24.19 39.02,24.43 v1(39.02,24.58) 39.02,25.92 38.89,26.05 ; 28.06,103.85 27.68,103.85 27.24,104.28 27.24,104.35 26.57,105.02 ; v1(28.92,116.45) 29.21,116.45 29.8,115.86 32,115.86 32.39,116.24 v1(32.39,116.37) ; v1(28.92,116.45) 28.65,116.45 28.5,116.3 28.25,116.3 28,116.05 28,115.83 27.94,115.76 27.94,114.54 27.48,114.07 27.48,113.67 28.08,113.07 28.08,112.94 27.99,112.85 27.86,112.85 27.72,112.99 v1(27.4,112.99) ; 25.64,98.71 26.45,98.71 26.64,98.9 ; 25.64,98.71 25.45,98.9 ; 23.5,104.34 23.5,104.58 ; 23.5,104.34 23.5,104.58 ; 23.5,104.34 23.27,104.1 ; 23.5,104.34 23.27,104.1 ; 23.5,104.58 23.76,104.83 ; 23.5,104.58 23.76,104.83 ; 32.38,87.64 32,88.02 30.15,88.02 30.14,88.03 29.79,88.03 29.79,88.02 29.33,88.02 v1(28.92,87.61) 28.65,87.61 28.5,87.46 28.37,87.46 28.28,87.55 28.28,88.62 28.06,88.85 27.67,88.85 27.24,89.28 27.24,89.35 26.57,90.02 26.5,90.02 26.4,90.12 26.05,90.12 25.95,90.02 25.52,90.02 25.33,89.83 23.76,89.83 23.5,89.58 23.5,89.34 23.27,89.1 v1(23.27,88.95) 23.27,87.61 USB5.A6 ; v1(23.27,103.95) 23.27,104.1 ; v1(23.27,103.95) 23.27,102.61 ; v1(23.27,103.95) 23.27,102.61 ; v1(23.27,103.95) 23.27,104.1 ; 38.89,116.05 39.02,115.92 v1(39.02,114.58) 39.02,114.43 38.78,114.19 38.78,113.95 38.53,113.69 37.03,113.69 36.7,113.36 35.67,113.36 35.34,113.69 34.87,113.69 34.07,114.49 34.07,115.72 34.01,115.78 34.01,116.01 33.92,116.1 33.79,116.1 33.64,115.95 v1(33.37,115.95) ; SW1.5 54.48,111.94 54.39,111.85 51.59,111.85 v1(50.48,112.96) ; v1(33.37,55.95) 33.64,55.95 33.79,56.1 33.92,56.1 34.01,56.01 34.01,55.78 34.07,55.72 34.07,54.49 34.87,53.69 35.34,53.69 35.67,53.36 36.7,53.36 37.03,53.69 38.53,53.69 38.78,53.95 38.78,54.19 39.02,54.43 v1(39.02,54.58) 39.02,55.92 38.89,56.05 ; 25.95,105.02 26.05,105.12 26.4,105.12 26.5,105.02 ; 25.33,104.83 25.52,105.02 ; 25.52,105.02 25.33,104.83 23.76,104.83 ; USB7.B6 24.02,70.85 v1(24.02,69.51) 24.02,69.36 23.79,69.12 23.79,68.99 23.88,68.9 25.45,68.9 25.64,68.71 26.45,68.71 26.64,68.9 27.3,68.9 27.94,69.54 27.94,70.76 28,70.83 28,71.05 28.25,71.3 28.5,71.3 28.65,71.45 v1(28.92,71.45) 29.21,71.45 29.8,70.86 32,70.86 32.38,71.24 v1(32.38,71.37) ; 27.94,99.54 27.31,98.9 ; 27.94,99.54 27.3,98.9 26.64,98.9 ; USB7.A6 23.27,72.61 v1(23.27,73.95) 23.27,74.1 23.5,74.34 23.5,74.58 23.76,74.83 25.33,74.83 25.52,75.02 25.95,75.02 26.05,75.12 26.4,75.12 26.5,75.02 26.57,75.02 27.24,74.35 27.24,74.28 27.67,73.85 28.06,73.85 28.28,73.62 28.28,72.55 28.37,72.46 28.5,72.46 28.65,72.61 v1(28.92,72.61) 29.33,73.02 29.79,73.02 29.79,73.03 30.14,73.03 30.15,73.02 32,73.02 32.38,72.64 ; 23.4,102.48 23.27,102.61 ; 23.27,102.61 USB3.A6 ; 26.57,105.02 26.5,105.02 26.41,105.12 ; 38.89,41.05 39.02,40.92 v1(39.02,39.58) 39.02,39.43 38.78,39.19 38.78,38.95 38.53,38.69 37.03,38.69 36.7,38.36 35.67,38.36 35.34,38.69 34.87,38.69 34.07,39.49 34.07,40.72 34.01,40.78 34.01,41.01 33.92,41.1 33.79,41.1 33.64,40.95 v1(33.37,40.95) ; 32.38,27.64 32,28.02 30.15,28.02 30.14,28.03 29.79,28.03 29.79,28.02 29.33,28.02 v1(28.92,27.61) 28.65,27.61 28.5,27.46 28.37,27.46 28.28,27.55 28.28,28.62 28.06,28.85 27.67,28.85 27.24,29.28 27.24,29.35 26.57,30.02 26.5,30.02 26.4,30.12 26.05,30.12 25.95,30.02 25.52,30.02 25.33,29.83 23.76,29.83 23.5,29.58 23.5,29.34 23.27,29.1 v1(23.27,28.95) 23.27,27.61 USB13.A6 ; 38.89,86.05 39.02,85.92 v1(39.02,84.58) 39.02,84.43 38.78,84.19 38.78,83.95 38.53,83.69 37.03,83.69 36.7,83.36 35.67,83.36 35.34,83.69 34.87,83.69 34.07,84.49 34.07,85.72 34.01,85.78 34.01,86.01 33.92,86.1 33.79,86.1 33.64,85.95 v1(33.37,85.95) ; v1(50.48,19.74) 51.59,18.63 54.27,18.63 54.52,18.38 54.65,18.38 54.74,18.47 SW2.5 ; 32.39,42.64 32,43.02 30.15,43.02 30.14,43.03 29.79,43.03 29.79,43.02 29.33,43.02 v1(28.92,42.61) 28.65,42.61 28.5,42.46 28.37,42.46 28.28,42.55 28.28,43.62 28.06,43.85 27.68,43.85 27.24,44.28 27.24,44.35 26.57,45.02 26.5,45.02 26.41,45.12 26.05,45.12 25.95,45.02 25.52,45.02 25.33,44.83 23.76,44.83 23.5,44.58 23.5,44.34 23.27,44.1 v1(23.27,43.95) 23.27,42.61 USB11.A6 ; USB1.B6 24.02,115.85 v1(24.02,114.51) 24.02,114.36 23.79,114.12 23.79,113.99 23.88,113.9 25.45,113.9 25.82,113.53 26.01,113.53 v1(26.04,113.5) ; v1(33.37,57.1) 33.64,57.1 33.79,57.25 34.03,57.25 34.29,57.51 34.29,58.58 34.35,58.64 34.73,58.64 35.33,59.24 35.33,59.31 35.84,59.82 35.91,59.82 36,59.91 36.13,59.91 36.22,59.82 36.65,59.82 36.84,59.63 38.42,59.63 38.51,59.54 38.51,59.41 38.27,59.17 v1(38.27,59.02) 38.27,57.68 38.4,57.55 ; 38.4,87.55 38.27,87.68 v1(38.27,89.02) 38.27,89.17 38.51,89.41 38.51,89.54 38.42,89.63 36.84,89.63 36.65,89.82 36.22,89.82 36.13,89.91 36,89.91 35.91,89.82 35.84,89.82 35.33,89.31 35.33,89.24 34.73,88.64 34.35,88.64 34.29,88.58 34.29,87.51 34.03,87.25 33.79,87.25 33.64,87.1 v1(33.37,87.1) ; 26.45,98.71 26.64,98.9 ; USB9.B6 24.02,55.85 v1(24.02,54.51) 24.02,54.36 23.79,54.12 23.79,53.99 23.88,53.9 25.45,53.9 25.64,53.71 26.45,53.71 26.64,53.9 27.31,53.9 27.94,54.54 27.94,55.76 28,55.83 28,56.05 28.25,56.3 28.5,56.3 28.65,56.45 v1(28.92,56.45) 29.21,56.45 29.8,55.86 32,55.86 32.39,56.24 v1(32.39,56.37) ; 38.4,102.55 38.27,102.68 v1(38.27,104.02) 38.27,104.17 38.51,104.41 38.51,104.54 38.42,104.63 36.84,104.63 36.65,104.82 36.22,104.82 36.13,104.91 36,104.91 35.91,104.82 35.84,104.82 35.33,104.31 35.33,104.24 34.73,103.64 34.35,103.64 34.29,103.58 34.29,102.51 34.03,102.25 33.79,102.25 33.64,102.1 v1(33.37,102.1)
  Bottom Layer w0.127: 33.89,119.93 31.71,119.93 31.62,119.84 31.62,80.61 arc(31.66,80.52) 31.75,80.48 arc(31.84,80.44) 31.88,80.35 31.88,80.11 arc(31.84,80.02) 31.75,79.98 arc(31.66,79.94) 31.62,79.85 31.62,79.61 arc(31.66,79.52) 31.75,79.48 arc(31.84,79.44) 31.88,79.35 31.88,79.11 arc(31.84,79.02) 31.75,78.98 arc(31.66,78.94) 31.62,78.85 31.62,78.61 arc(31.66,78.52) 31.75,78.48 arc(31.84,78.44) 31.88,78.35 31.88,78.11 arc(31.84,78.02) 31.75,77.98 arc(31.66,77.94) 31.62,77.85 31.62,77.61 arc(31.66,77.52) 31.75,77.48 arc(31.84,77.44) 31.88,77.35 31.88,77.11 arc(31.84,77.02) 31.75,76.98 arc(31.66,76.94) 31.62,76.85 31.62,27 ; 33.89,119.93 33.96,119.86 52.92,119.86 53.65,119.13 53.65,111.86 53.64,111.85 53.52,111.85 52.41,112.96 50.53,112.96 ; 33.89,119.93 33.78,119.82 v1(33.78,119.59) ; 32.96,117.1 31.72,117.1 ; 32.96,117.1 v1(32.39,117.68) ; 32.96,117.1 v1(33.37,117.1) ; v1(32.39,41.37) 32.77,40.99 32.77,40.95 ; v1(27.4,112.99) 27.4,112.95 27.31,112.85 26.76,112.85 26.69,112.78 26.56,112.78 26.47,112.87 26.47,113.07 v1(26.04,113.5) ; 31.62,27 31.72,27.1 32.96,27.1 ; 31.62,27 31.62,25.94 ; 50.53,19.74 48.65,19.74 47.54,18.63 32.43,18.63 ; v1(32.38,71.37) 32.77,70.99 32.77,70.95 ; 32.77,25.95 31.63,25.95 31.62,25.94 ; 32.77,25.95 32.77,25.99 v1(32.38,26.37) ; 32.77,25.95 v1(33.37,25.95) ; 32.77,85.95 32.77,85.99 v1(32.38,86.37) ; 32.77,85.95 v1(33.37,85.95) ; 32.77,85.95 31.63,85.95 ; 33.37,100.95 32.77,100.95 ; 32.77,100.95 32.77,100.99 v1(32.39,101.37) ; 32.77,100.95 31.63,100.95 ; v1(33.37,55.95) 32.77,55.95 ; 32.77,55.95 31.63,55.95 ; 32.77,55.95 32.77,55.99 v1(32.39,56.37) ; 32.77,40.95 v1(33.37,40.95) ; 32.77,40.95 31.63,40.95 ; 32.96,102.1 31.72,102.1 ; 32.96,102.1 33.37,102.1 ; 32.96,102.1 v1(32.39,102.68) ; 32.77,70.95 31.63,70.95 ; 32.77,70.95 33.37,70.95 ; 32.96,57.1 v1(33.37,57.1) ; 32.96,57.1 v1(32.39,57.68) ; 32.96,57.1 31.72,57.1 ; 32.96,87.1 v1(33.37,87.1) ; 32.96,87.1 31.72,87.1 ; 32.96,87.1 v1(32.38,87.68) ; 31.62,25.94 31.62,18.88 31.86,18.63 32.43,18.63 ; v1(32.39,116.37) 32.81,115.95 v1(33.37,115.95) ; v1(32.38,27.68) 32.96,27.1 ; 32.96,27.1 v1(33.37,27.1) ; 32.96,42.1 31.72,42.1 ; 32.96,42.1 v1(33.37,42.1) ; 32.96,42.1 v1(32.39,42.68) ; 32.43,18.63 32.43,18.95 v1(32.26,19.13) ; 32.96,72.1 31.72,72.1 ; 32.96,72.1 33.37,72.1 ; 32.96,72.1 v1(32.38,72.68)
